# Altium project EmbeddedControlSystem_Hengeveld4331.PrjPcb (part 1 of 2)
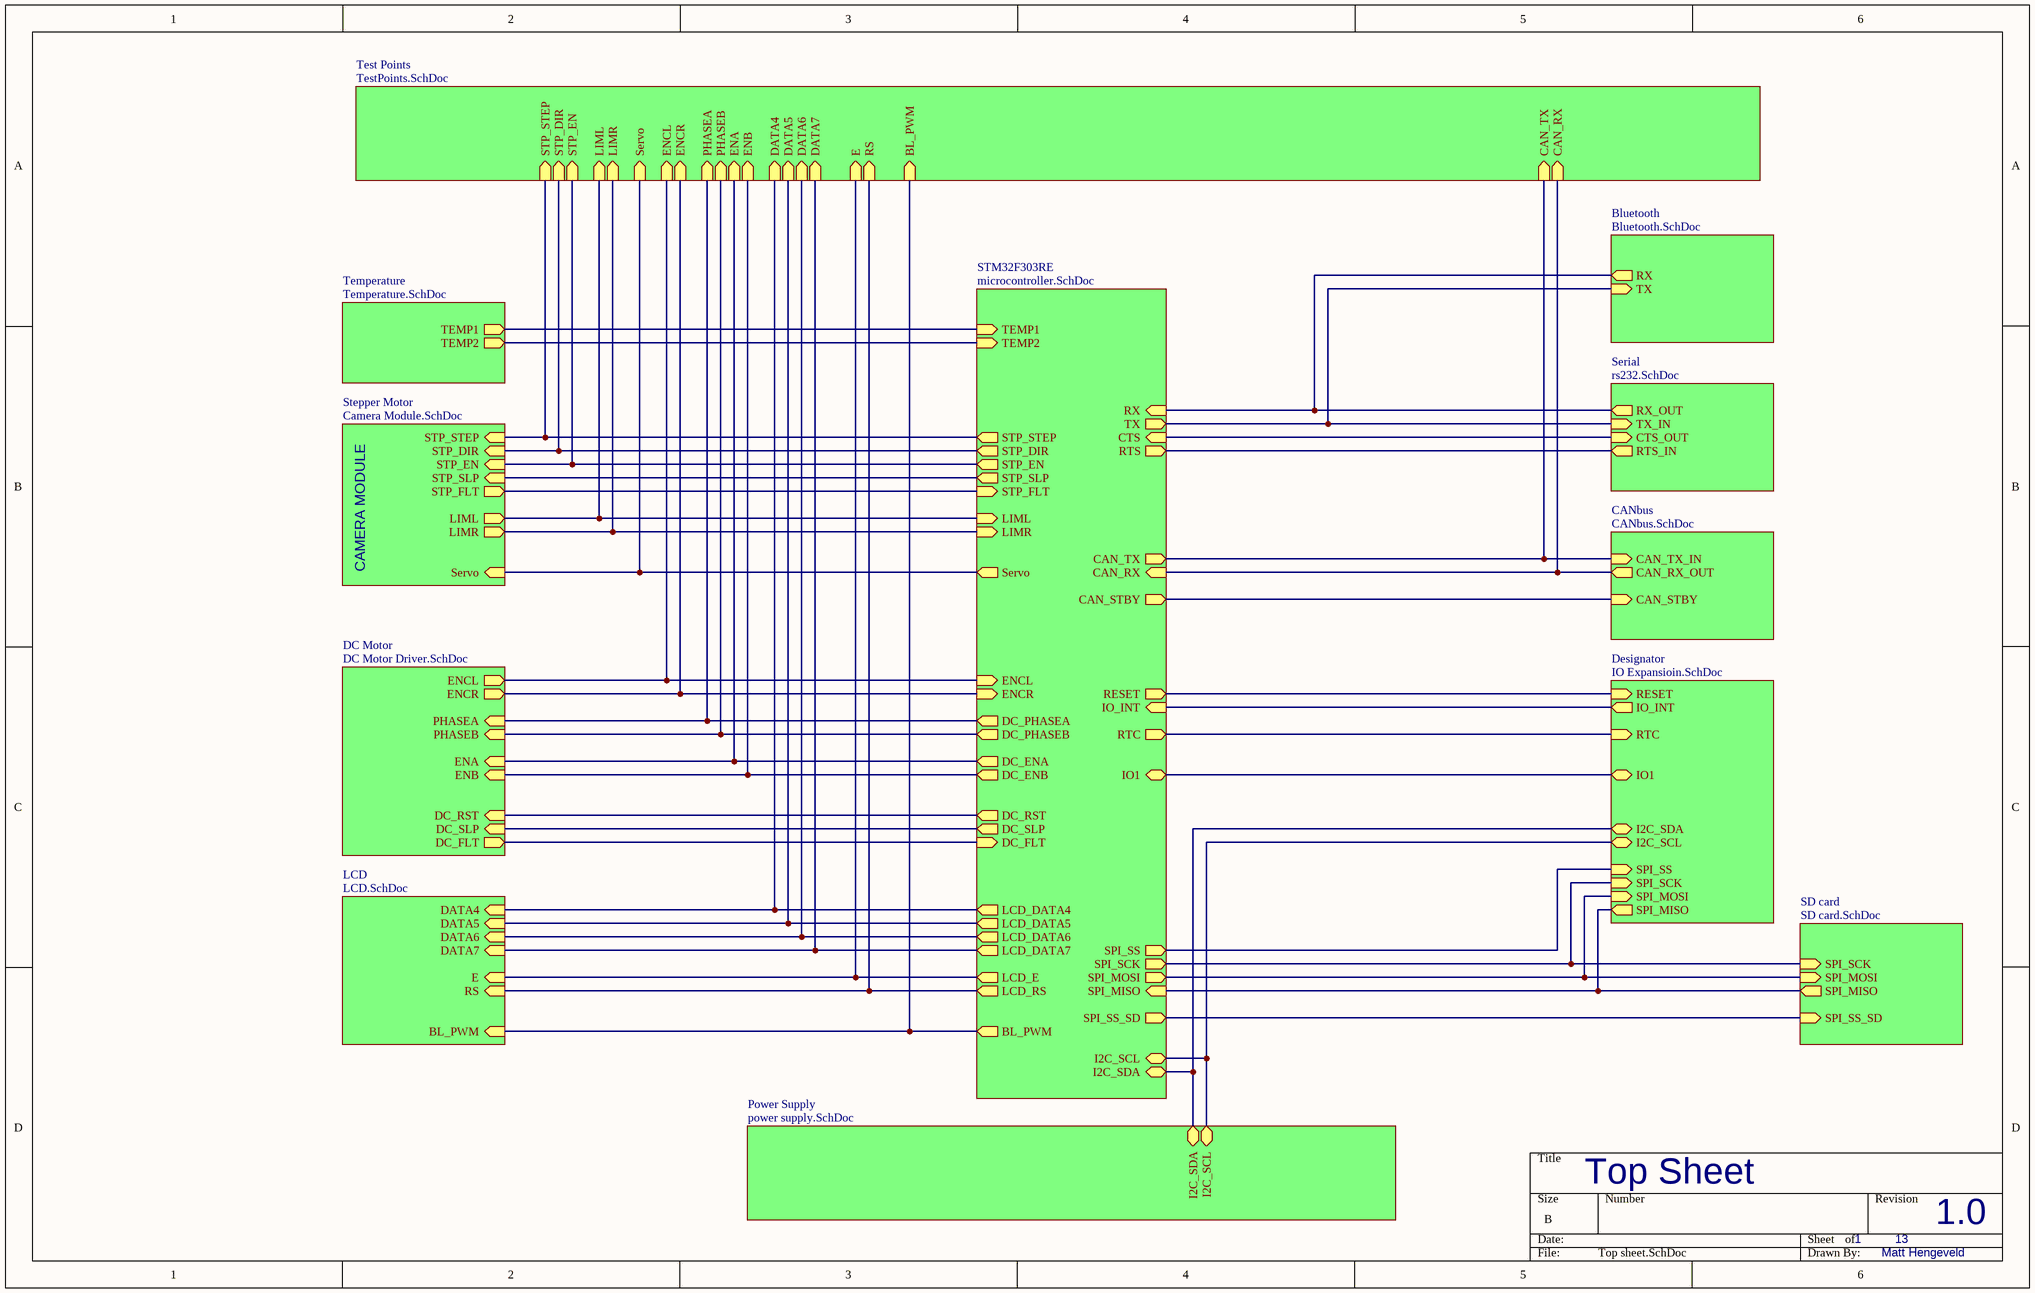
[diagram p0: Top sheet.SchDoc]
13 sheets, 193 parts. Net scope: hierarchical (ports join the sheet entries above them; power ports are global).
Board file: controller.PcbDoc
Sheets:
  Top sheet.SchDoc
    Power Supply = power supply.SchDoc
    STM32F303RE = microcontroller.SchDoc
    Stepper Motor = Camera Module.SchDoc
    DC Motor = DC Motor Driver.SchDoc
    LCD = LCD.SchDoc
    Serial = rs232.SchDoc
    CANbus = CANbus.SchDoc
    Designator = IO Expansioin.SchDoc
    Temperature = Temperature.SchDoc
    SD card = SD card.SchDoc
    Test Points = TestPoints.SchDoc
    Bluetooth = Bluetooth.SchDoc

## Sheet Top sheet.SchDoc
size B

### Sub-sheets
Bluetooth = Bluetooth.SchDoc: RX (out), TX (in)
CANbus = CANbus.SchDoc: CAN_TX_IN (in), CAN_RX_OUT (out), CAN_STBY (in)
DC Motor = DC Motor Driver.SchDoc: PHASEA (in), ENCL (out), ENA (in), DC_FLT (out), DC_SLP (in), DC_RST (in), ENCR (out), PHASEB (in), ENB (in)
Designator = IO Expansioin.SchDoc: SPI_MISO (out), SPI_MOSI (in), SPI_SCK (in), SPI_SS (in), IO_INT (out), RESET (in), I2C_SDA (bidir), I2C_SCL (bidir), RTC (in), IO1 (bidir)
LCD = LCD.SchDoc: DATA4 (in), E (in), RS (in), BL_PWM (in), DATA5 (in), DATA6 (in), DATA7 (in)
Power Supply = power supply.SchDoc: I2C_SDA (bidir), I2C_SCL (bidir)
SD card = SD card.SchDoc: SPI_SCK (in), SPI_MOSI (in), SPI_MISO (out), SPI_SS_SD (in)
Serial = rs232.SchDoc: TX_IN (in), RTS_IN (out), RX_OUT (out), CTS_OUT (in)
Stepper Motor = Camera Module.SchDoc: STP_STEP (in), LIML (out), STP_EN (in), STP_SLP (in), STP_FLT (out), Servo (in), STP_DIR (in), LIMR (out)
STM32F303RE = microcontroller.SchDoc: Servo (out), STP_STEP (out), DC_PHASEA (out), DC_ENA (out), LCD_RS (out), LCD_E (out), LCD_DATA4 (out), RX (in), CAN_TX (out), TX (out), CTS (in), RTS (out), CAN_RX (in), CAN_STBY (out), DC_FLT (in), DC_SLP (out), DC_RST (out), STP_FLT (in), STP_SLP (out), STP_EN (out), BL_PWM (out), ENCL (in), LIML (in), STP_DIR (out), SPI_SS (out), SPI_SCK (out), SPI_MOSI (out), I2C_SCL (bidir), I2C_SDA (bidir), SPI_MISO (in), IO_INT (in), RESET (out), LCD_DATA5 (out), LCD_DATA6 (out), LCD_DATA7 (out), ENCR (in), DC_PHASEB (out), DC_ENB (out), LIMR (in), RTC (out), IO1 (bidir), TEMP1 (in), TEMP2 (in), SPI_SS_SD (out)
Temperature = Temperature.SchDoc: TEMP1 (out), TEMP2 (out)
Test Points = TestPoints.SchDoc: STP_STEP (in), STP_DIR (in), STP_EN (in), LIML (in), LIMR (in), Servo (in), ENCL (in), ENCR (in), PHASEA (in), PHASEB (in), ENA (in), ENB (in), DATA4 (in), DATA5 (in), DATA6 (in), DATA7 (in), CAN_RX (in), CAN_TX (in), E (in), RS (in), BL_PWM (in)

### Nets
BL: sheet STM32F303RE/BL_PWM, sheet LCD/BL_PWM, sheet Test Points/BL_PWM
DB4: sheet STM32F303RE/LCD_DATA4, sheet LCD/DATA4, sheet Test Points/DATA4
DB5: sheet STM32F303RE/LCD_DATA5, sheet LCD/DATA5, sheet Test Points/DATA5
DB6: sheet STM32F303RE/LCD_DATA6, sheet LCD/DATA6, sheet Test Points/DATA6
DB7: sheet STM32F303RE/LCD_DATA7, sheet LCD/DATA7, sheet Test Points/DATA7
DC_FLT: sheet STM32F303RE/DC_FLT, sheet DC Motor/DC_FLT
DC_RST: sheet STM32F303RE/DC_RST, sheet DC Motor/DC_RST
DC_SLP: sheet STM32F303RE/DC_SLP, sheet DC Motor/DC_SLP
E: sheet STM32F303RE/LCD_E, sheet LCD/E, sheet Test Points/E
I2C_SCL: sheet Power Supply/I2C_SCL, sheet STM32F303RE/I2C_SCL, sheet Designator/I2C_SCL
I2C_SDA: sheet Power Supply/I2C_SDA, sheet STM32F303RE/I2C_SDA, sheet Designator/I2C_SDA
MISO: sheet STM32F303RE/SPI_MISO, sheet Designator/SPI_MISO, sheet SD card/SPI_MISO
MOSI: sheet STM32F303RE/SPI_MOSI, sheet Designator/SPI_MOSI, sheet SD card/SPI_MOSI
PA0: sheet STM32F303RE/CTS, sheet Serial/CTS_OUT
PA1: sheet STM32F303RE/RTS, sheet Serial/RTS_IN
PA2: sheet STM32F303RE/TX, sheet Serial/TX_IN, sheet Bluetooth/TX
PA3: sheet STM32F303RE/RX, sheet Serial/RX_OUT, sheet Bluetooth/RX
PA4: sheet STM32F303RE/LCD_RS, sheet LCD/RS, sheet Test Points/RS
PA5: sheet STM32F303RE/IO1, sheet Designator/IO1
PA6: sheet STM32F303RE/TEMP1, sheet Temperature/TEMP1
PA7: sheet STM32F303RE/TEMP2, sheet Temperature/TEMP2
PA8: sheet STM32F303RE/ENCL, sheet DC Motor/ENCL, sheet Test Points/ENCL
PA9: sheet STM32F303RE/ENCR, sheet DC Motor/ENCR, sheet Test Points/ENCR
PA10: sheet STM32F303RE/STP_FLT, sheet Stepper Motor/STP_FLT
PA11: sheet STM32F303RE/CAN_RX, sheet CANbus/CAN_RX_OUT, sheet Test Points/CAN_RX
PA12: sheet STM32F303RE/CAN_TX, sheet CANbus/CAN_TX_IN, sheet Test Points/CAN_TX
PA15: sheet STM32F303RE/Servo, sheet Stepper Motor/Servo, sheet Test Points/Servo
PB1: sheet STM32F303RE/LIML, sheet Stepper Motor/LIML, sheet Test Points/LIML
PB2: sheet STM32F303RE/LIMR, sheet Stepper Motor/LIMR, sheet Test Points/LIMR
PB3: sheet STM32F303RE/STP_EN, sheet Stepper Motor/STP_EN, sheet Test Points/STP_EN
PB4: sheet STM32F303RE/STP_DIR, sheet Stepper Motor/STP_DIR, sheet Test Points/STP_DIR
PB5: sheet STM32F303RE/STP_STEP, sheet Stepper Motor/STP_STEP, sheet Test Points/STP_STEP
PB6: sheet STM32F303RE/SPI_SS_SD, sheet SD card/SPI_SS_SD
PB10: sheet STM32F303RE/IO_INT, sheet Designator/IO_INT
PB11: sheet STM32F303RE/CAN_STBY, sheet CANbus/CAN_STBY
PB12: sheet STM32F303RE/SPI_SS, sheet Designator/SPI_SS
PB13: sheet STM32F303RE/SPI_SCK, sheet Designator/SPI_SCK, sheet SD card/SPI_SCK
PC4: sheet STM32F303RE/STP_SLP, sheet Stepper Motor/STP_SLP
PC5: sheet STM32F303RE/DC_PHASEA, sheet DC Motor/PHASEA, sheet Test Points/PHASEA
PC6: sheet STM32F303RE/DC_PHASEB, sheet DC Motor/PHASEB, sheet Test Points/PHASEB
PC8: sheet STM32F303RE/DC_ENA, sheet DC Motor/ENA, sheet Test Points/ENA
PC9: sheet STM32F303RE/DC_ENB, sheet DC Motor/ENB, sheet Test Points/ENB
PC13: sheet STM32F303RE/RTC, sheet Designator/RTC
RESET: sheet STM32F303RE/RESET, sheet Designator/RESET

### Notes on the sheet
- CAMERA MODULE
- Top Sheet
- 1
- 13
- 1.0
- Matt Hengeveld

## Sheet power supply.SchDoc
size A
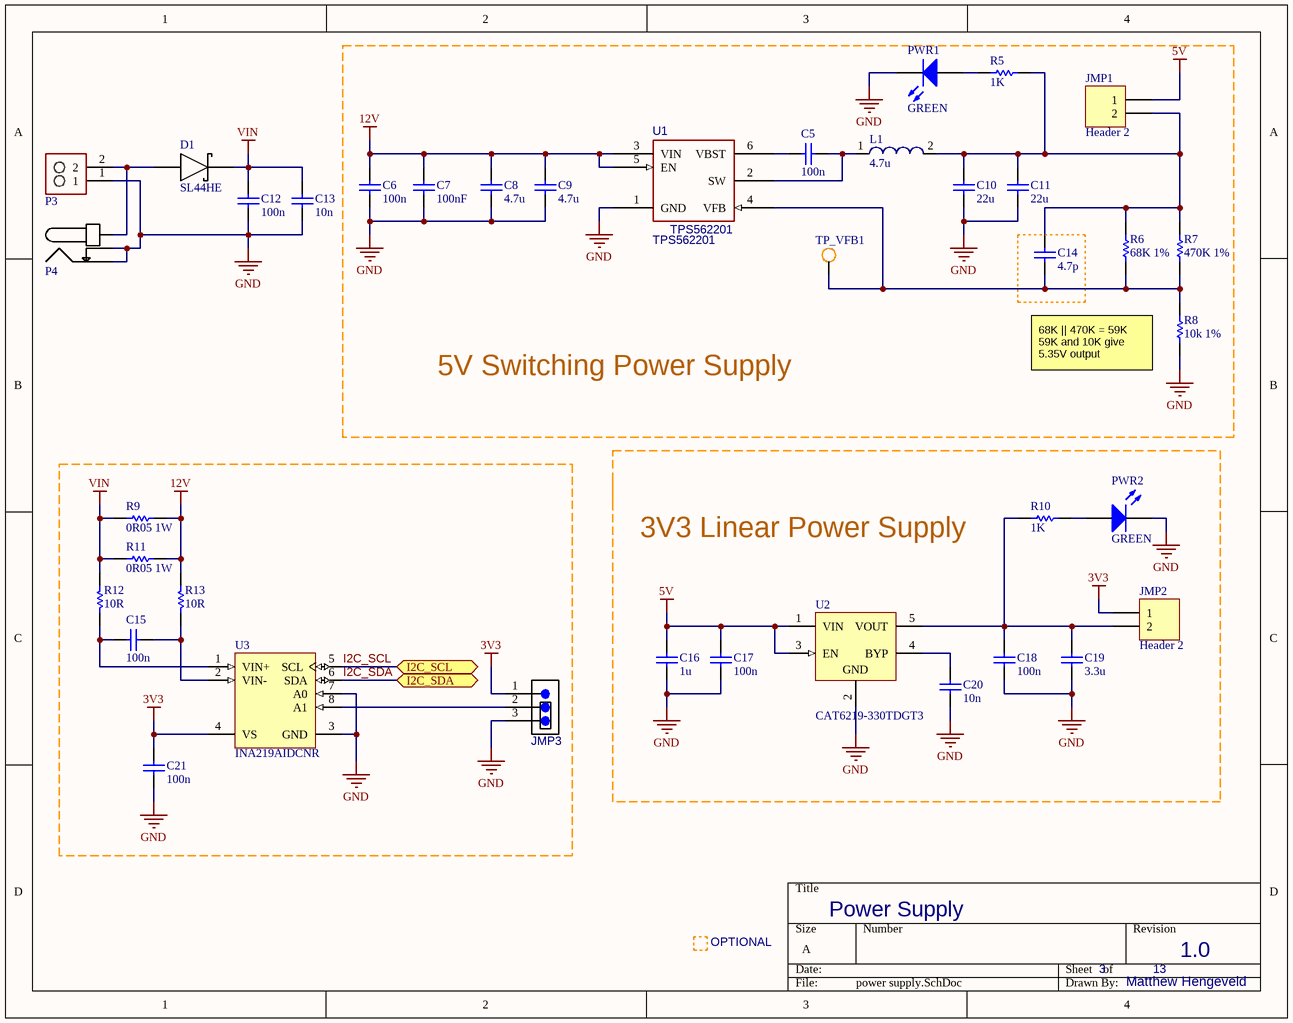
[diagram p1: power supply.SchDoc]

### Parts
C5  100n  [CAPC2113X100X50LL30T25]
C6  100n  [CAPC1608X90X35LL15T15]
C7  100nF  [CAPC2013X94X50LL20T25]
C8  4.7u  [CAPC3225X220X20ML40]
C9  4.7u  [CAPC3225X220X20ML40]
C10  22u  [CAPC3225X220X20ML40]
C11  22u  [CAPC3225X220X20ML40]
C12  100n  [CAPC2013X95X45LL15T25]
C13  10n  [CAPC2013X95X45LL15T25]
C14  4.7p  [CAPC1608X87X35LL15T15]
C15  100n  [CAPC1608X87X35LL15T15]
C16  1u  [CAPC2013X140X50LL20T25]
C17  100n  [CAPC1608X87X35LL15T15]
C18  100n  [CAPC1608X87X35LL15T15]
C19  3.3u  [CAPC3225X220X20ML40]
C20  10n  [CAPC1608X87X35LL15T15]
C21  100n  [CAPC1608X87X35LL15T15]
D1  SL44HE  [SMC Diode]
JMP1  Header 2  [HDR1X2]
JMP2  Header 2  [HDR1X2]
JMP3  SMD_JMP  [0603_JUMPER]  (value not drawn)
L1  4.7u  [WE-LQS 6045]
P3  2PIN_SCREW_TERM_3_5MM  [2PIN_SCREWW_TERM_3_5MM]  (value not drawn)
P4  Barrel Jack  [2.1x5.5mm Barrel Jack - Holes]  (value not drawn)
PWR1  GREEN  [0805_A]
PWR2  GREEN  [0805_A]
R5  1K  [RESC1608X55X30LL15T15]
R6  68K 1%  [RESC1608X55X30LL15T15]
R7  470K 1%  [RESC1608X55X30LL15T15]
R8  10k 1%  [RESC1608X55X30LL15T15]
R9  0R05 1W  [ROHM-MCR100-2_V]
R10  1K  [RESC1608X55X30LL15T15]
R11  0R05 1W  [ROHM-MCR100-2_V]
R12  10R  [RESC1608X55X30LL15T15]
R13  10R  [RESC1608X55X30LL15T15]
TP_VFB1  Test point  [SMD Test Hook]  (value not drawn)
U1  TPS562201  [MCHP-SOT-23-OT6_N]
U2  CAT6219-330TDGT3  [SOT-23-5]
U3  INA219AIDCNR  [SOT-23-8]

### Blocks framed on the sheet
5V Switching Power Supply: C5-C11 C14 JMP1 L1 PWR1 R5-R8 TP_VFB1 U1

### Ports
I2C_SCL (bidir), I2C_SDA (bidir)

### Nets
3V3: C21.2 JMP2.1 JMP3.1 U3.4(VS)
5V: C16.2 C17.2 JMP1.1 U2.1(VIN) U2.3(EN)
12V: C6.2 C7.1 C8.2 C9.2 R9.2 R11.2 R13.1 U1.3(VIN) U1.5(EN)
GND: C6.1 C7.2 C8.1 C9.1 C10.1 C11.1 C12.1 C13.1 C16.1 C17.1 C18.1 C19.1 C20.1 C21.1 JMP3.3 P3.1 P4.2 P4.3 PWR1.1(K) PWR2.1(K) R8.1 U1.1(GND) U2.2(GND) U3.3(GND) U3.7(A0)  [project net AGND]
VIN: C12.2 C13.2 D1.1(K) R9.1 R11.1 R12.1
I2C_SCL: U3.5(SCL) ; port I2C_SCL
I2C_SDA: U3.6(SDA) ; port I2C_SDA
NetC5_1: C5.1 U1.6(VBST)
NetC5_2: C5.2 L1.1 U1.2(SW)
NetC10_2: C10.2 C11.2 C14.2 JMP1.2 L1.2 R5.1 R6.2 R7.2
NetC14_1: C14.1 R6.1 R7.1 R8.2 TP_VFB1.1(point) U1.4(VFB)
NetC15_1: C15.1 R12.2 U3.1(VIN+)
NetC15_2: C15.2 R13.2 U3.2(VIN-)
NetC18_2: C18.2 C19.2 JMP2.2 R10.2 U2.5(VOUT)
NetC20_2: C20.2 U2.4(BYP)
NetD1_2: D1.2(A) P3.2 P4.1
NetJMP3_2: JMP3.2 U3.8(A1)
NetPWR1_2: PWR1.2(A) R5.2
NetPWR2_2: PWR2.2(A) R10.1

### Notes on the sheet
- (near R8) 68K || 470K = 59K
  59K and 10K give 5.35V output
- 3V3 Linear Power Supply
- OPTIONAL
- Power Supply
- 3
- 13
- 1.0
- Matthew Hengeveld

### Library data of the parts
C5 = CMP-2007-00009-1: Manufacturer: Kemet; Part Number: C0805X104K5RACTU
C6 = CMP-2006-04389-2: Chip Capacitor, 100 nF, +/- 10%, 50 V, -55 to 125 degC, 0603 (1608 Metric), RoHS, Tape and Reel; Case\Package: 0603; Type (Capacitors): X7R; Capacitance: 100 nF; Voltage Rating: 50 V; Pins: 2; Max Operating Temperature: 125 degC; Min Operating Temperature: -55 degC; Case Code (Imperial): 0603; DatasheetVersion: 07/2016; Package Quantity: 4000; Length: 1.6 mm; REACH SVHC: No SVHC; Packaging: Tape and Reel; Case Code (Metric): 1608; Mounting Technology: Surface Mount; RoHSCompliant: true; Height: 0.9 mm; ComponentLink1URL: http://www.avx.com/; ComponentLink2URL: http://datasheets.avx.com/X7RDielectric.pdf; Mount: Surface Mount; ComponentLink2Description: Datasheet; Width: 0.81 mm; PackageReference: 0603; PackageDescription: 2-Pin Surface Mount Device, Body 1.6 x 0.81 mm; Radiation Hardening: No; ComponentLink1Description: Manufacturer URL; Voltage Rating (DC): 50 V; Tolerance: 10%
C7 = CMP-2007-04370-1: Part Number: 08055C104K4T2A; Manufacturer: AVX Interconnect / Elco
C8-C11 C19 = CMP-2000-06054-1: Chip Capacitor, 4.7 uF, +/- 20%, 100 V, -55 to 125 degC, 1210 (3225 Metric), RoHS, Tape and Reel; PCN Part Number: MLCCPartNumberChange30/Nov/2012; Manufacturer: TDK; Online Catalog: CSeries,MidVoltage; Featured Product: MidVoltageX7S-100VMLCCsC-SeriesMidVoltageMLCCs; Capacitance: 4.7µF; Temperature Coefficient: X7S; Voltage - Rated: 100V; Product Training Modules: SEAT,CCV,andTVCLDesignToolsCSeriesMidVoltageCapacitorsFamilyGuidetoReplacinganElectrolyticCapacitorwithanMLCC; Other Names: 445-6043-6; Catalog Drawings: CSERIES_1210_2.2; Datasheet Version: 03/2015; Package Reference: 3225; Category: Capacitors; RoHS Information: RoHSCertificate-MLCC; Packaging: Digi-Reel®; Lead Spacing: -; Mounting Type: SurfaceMount,MLCC; Family: CeramicCapacitors; Applications: GeneralPurpose; Thickness (Max): 0.087"(2.20mm); Series: C; Height - Seated (Max): -; Datasheet URL: https://product.tdk.com/info/en/catalog/datasheets/mlcc_commercial_midvoltage_en.pdf; Lead Style: -; Features: -; Mounting Technology: SurfaceMount; Package / Case: 1210(3225Metric); Operating Temperature: -55°C~125°C; Manufacturer URL: http://www.tdk.com/; Standard Package: 1; Package Description: 2-Pin Surface Mount Device, Body 3.2 x 2.5 mm; Tolerance: ±20%; Ratings: -; Size / Dimension: 0.126"Lx0.098"W(3.20mmx2.50mm)
C12 C13 = CMP-2007-00072-1: Part Number: GCM2195C1H103JA16D; Manufacturer: Murata
C14 C17 C18 C20 = CMP-2006-03057-1: Manufacturer: Kemet; Part Number: C0603C104K3RACTU
C15 C21 = CMP-2006-03300-1: Part Number: C0603X104K5RACTU; Manufacturer: Kemet
C16 = CMP-2007-04672-1: Part Number: 0805ZC105KAT2A; Manufacturer: AVX Interconnect / Elco
D1 = SL44HE: Schottky Power Rectifier, 2-Pin SMC, 40V, 8A; PartNumber: MBRS540T3; Manufacturer: On Semiconductor; IFSM Max (A): 190; Configuration: Single; Packing: Tape and Reel; ComponentLink1Description: Manufacturer URL; ComponentLink3URL: http://www.onsemi.com/pub_link/Collateral/403-03.PDF; DatasheetVersion: Rev. 8; ComponentLink2Description: Datasheet; PackageReference: SMC-2-403-03; PackageDescription: 2-Pin Small Molded Package, J-Bend Lead, Body 5.845 x 6.855 mm; PackageVersion: Rev. E, 08/2005; ComponentLink1URL: http://www.onsemi.com/; ComponentLink2URL: http://www.onsemi.cn/pub_link/Collateral/MBRS540T3-D.PDF; RoHS: FALSE; ComponentLink3Description: Package Specification; Mounting Technology: Surface Mount
JMP1 JMP2 = Header 2: Header, 2-Pin; LatestRevisionDate: 17-Jul-2002; LatestRevisionNote: Re-released for DXP Platform.; Publisher: Altium Limited
L1 = CMP-1354-00077-1: WE-LQS SMD Power Inductor, L=4.7 µH; Manufacturer: Wuerth Elektronik; PartNumber: 74404064047; Inductance: 4.7 ÂµH; PackageReference: WE-LQS 6045; ComponentLink2URL: http://katalog.we-online.de/pbs/datasheet/74404064047.pdf; ComponentLink1Description: Manufacturer URL; ComponentLink1URL: http://www.we-online.com; ComponentLink2Description: Datasheet
PWR1 PWR2 = CMP-1426-00011-1: SMD mono-color Chip LED, WL-SMCW, Red; PartNumber: 150080RS75000; Manufacturer: Wuerth Elektronik; Color: Red; PackageReference: 0805_A; ComponentLink2Description: Datasheet; ComponentLink1URL: http://www.we-online.com; ComponentLink1Description: Manufacturer URL; ComponentLink2URL: http://katalog.we-online.com/led/datasheet/150080RS75000.pdf
R5-R8 R10 = CMP-2000-00181-1: Part Number: ERJ-3EKF1002V; Manufacturer: Panasonic
R9 R11 = CMP-1238-00003-1: PartNumber: MCR100JZHFLR470; Manufacturer: ROHM Semiconductor; Resistance: 0.47 Ohm; Packing: Tape; Overload Voltage: 6.02 V Max.; Limiting Element Voltage: 3.01 V; Resistance Tolerance: +/-1%; PackageDescription: 2-Pin Chip Resistor, Body 6.3 x 3.2 mm, Height 0.7 mm; Rated Power@70 degC: 1 W; ComponentLink3Description: Package Specification; ComponentLink2Description: Datasheet; DatasheetVersion: Rev. C; ComponentLink2URL: http://rohmfs.rohm.com/en/products/databook/datasheet/passive/resistor/chip_resistor/mcr_low.pdf; Operating Temperature: -55 to 125 degC; ComponentLink3URL: http://rohmfs.rohm.com/en/products/databook/datasheet/passive/resistor/chip_resistor/mcr_low.pdf; ComponentLink1URL: http://www.rohm.com/web/global/; Mounting Technology: Surface Mount; RoHS: TRUE; ComponentLink1Description: Manufacturer URL
R12 R13 = CMP-2000-00704-1: Manufacturer: Panasonic; Part Number: ERJ-3GEYJ103V
U2 = CAT6219: Fixed Low Drop Positive Voltage Regulator, 3.3V, 5-Pin TSOT-23, Tape and Reel; Manufacturer: ON Semiconductor; PSRR (dB): 64; VI Max (V): 5.5; Output: Single; Iq Typ (mA): 0.085; Noise (uVrms): 45; VDO Typ (V): 0.3; Io Typ(A): 0.5; Vo(V): 3.3; Polarity: Positive; DatasheetVersion: Rev. 14; Package Type: TSOT-23-5; RoHS: Pb-free; Mounting Technology: Surface Mount; ComponentLink1URL: http://www.onsemi.com/; PartNumber: CAT6219-330TDGT3; ComponentLink3Description: Package Specification; ComponentLink2URL: http://www.onsemi.com/pub_link/Collateral/CAT6219-D.PDF; ComponentLink3URL: http://www.onsemi.com/pub_link/Collateral/419AE.PDF; PackageVersion: Rev. O; ComponentLink1Description: Manufacturer URL; PackageReference: TSOT-23; ComponentLink2Description: Datasheet; PackageDescription: 5-Pin Plastic Small Outline Package, Body 2.9 x 1.6mm, Pitch 0.95mm
U3 = INA219: Zero-Drift, Bi-directional Current / Power Monitor, 3 to 5.5 V, -40 to 125 degC, 8-pin SOP (DCN8), Green (RoHS & no Sb/Br); Manufacturer: Texas Instruments; Input Offset (+/-)(Max)(uV): 100; Small-Signal Bandwidth(Typ)(MHz): 0.011; SubFamily: Current Shunt Monitor; Rating: Catalog; Quiescent Current (+/-)(Typ)(mA): 0.7; Vs(Max)(V): 5.5; Common Mode Range(Min)(V): 0; Vs(Min)(V): 3; Common Mode Range(Max)(V): 26; Gain(V/V): 1, 0.5, 0.25, 0.125; ComponentLink3URL: http://www.ti.com/lit/ml/mpds099c/mpds099c.pdf; ComponentLink2URL: http://www.ti.com/general/docs/lit/getliterature.tsp?genericPartNumber=INA219&fileType=pdf; PackageReference: DCN0008A; ComponentLink1URL: http://www.ti.com/; ComponentLink1Description: Manufacturer URL; Code_JEDEC: MO-178; CMRR(Min)(dB): 100; DatasheetVersion: SBOS448F; Mounting Technology: Surface Mount; ComponentLink3Description: Package Specification; PartNumber: INA219AIDCNR; PackageVersion: 4202106/D, 11/2009; Eco-Plan: Green (RoHS & no Sb/Br); ComponentLink2Description: Datasheet; PackageDescription: 8-Pin Plastic Small Outline, Body 1.6 x 2.9 mm, Pitch 0.65 mm

## Sheet microcontroller.SchDoc
size A4
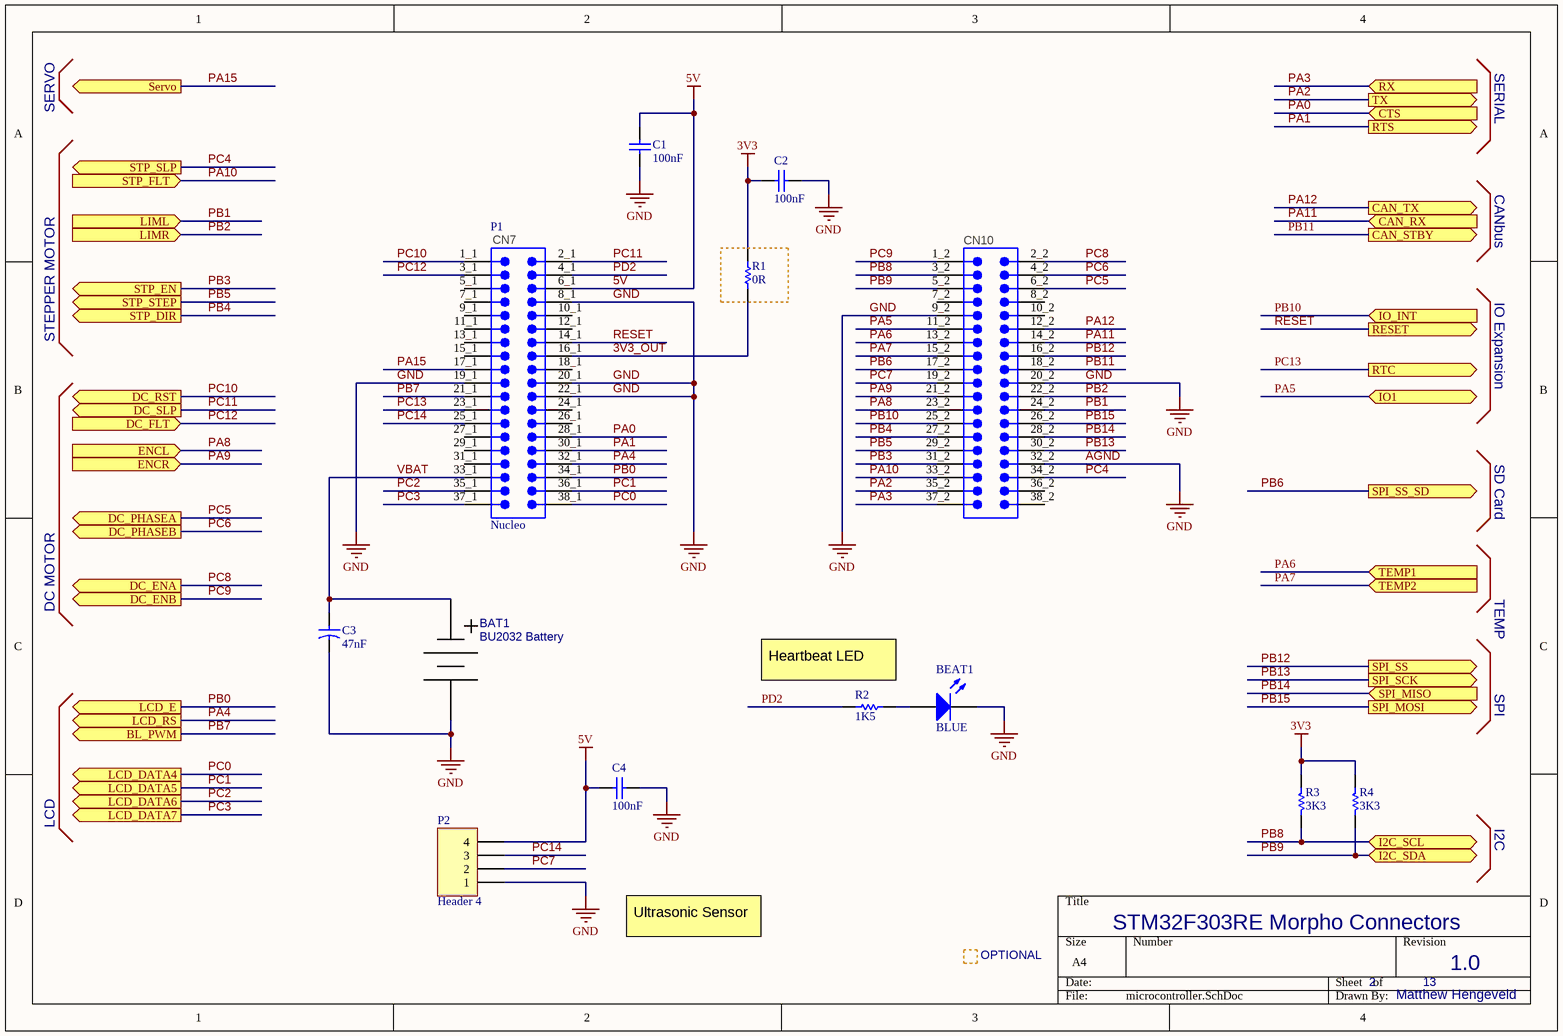
[diagram p2: microcontroller.SchDoc]

### Parts
BAT1  BU2032 Battery  [BU2032]
BEAT1  BLUE  [0805_A]
C1  100nF  [CAPC1608X92X38LL15T08]
C2  100nF  [CAPC1608X92X38LL15T08]
C3  47nF  [FILM_CAp]
C4  100nF  [CAPC1608X92X38LL15T08]
P1  Nucleo  [NUCLEO]
P2  Header 4  [HDR1X4]
R1  0R  [RESC1608X55X30LL15T15]
R2  1K5  [RESC1608X55X30LL15T15]
R3  3K3  [RESC1608X55X30LL15T15]
R4  3K3  [RESC1608X55X30LL15T15]

### Ports
BL_PWM (out), CAN_RX (in), CAN_STBY (out), CAN_TX (out), CTS (in), DC_ENA (out), DC_ENB (out), DC_FLT (in), DC_PHASEA (out), DC_PHASEB (out), DC_RST (out), DC_SLP (out), ENCL (in), ENCR (in), I2C_SCL (bidir), I2C_SDA (bidir), IO1 (bidir), IO_INT (in), LCD_DATA4 (out), LCD_DATA5 (out), LCD_DATA6 (out), LCD_DATA7 (out), LCD_E (out), LCD_RS (out), LIML (in), LIMR (in), RESET (out), RTC (out), RTS (out), RX (in), Servo (out), SPI_MISO (in), SPI_MOSI (out), SPI_SCK (out), SPI_SS (out), SPI_SS_SD (out), STP_DIR (out), STP_EN (out), STP_FLT (in), STP_SLP (out), STP_STEP (out), TEMP1 (in), TEMP2 (in), TX (out)

### Nets
3V3: C2.2 R1.2 R3.1 R4.1
5V: C1.2 C4.2 P1.6_1 P2.4
AGND: BAT1.- BEAT1.1(K) C1.1 C2.1 C3.2 C4.1 P1.8_1 P1.9_2 P1.19_1 P1.20_1 P1.20_2 P1.22_1 P1.32_2 P2.1  [also labelled GND]
3V3_OUT: P1.16_1 R1.1
PA0: P1.28_1 ; port CTS
PA1: P1.30_1 ; port RTS
PA2: P1.35_2 ; port TX
PA3: P1.37_2 ; port RX
PA4: P1.32_1 ; port LCD_RS
PA5: P1.11_2 ; port IO1
PA6: P1.13_2 ; port TEMP1
PA7: P1.15_2 ; port TEMP2
PA8: P1.23_2 ; port ENCL
PA9: P1.21_2 ; port ENCR
PA10: P1.33_2 ; port STP_FLT
PA11: P1.14_2 ; port CAN_RX
PA12: P1.12_2 ; port CAN_TX
PA15: P1.17_1 ; port Servo
PB0: P1.34_1 ; port LCD_E  [project net E]
PB1: P1.24_2 ; port LIML
PB2: P1.22_2 ; port LIMR
PB3: P1.31_2 ; port STP_EN
PB4: P1.27_2 ; port STP_DIR
PB5: P1.29_2 ; port STP_STEP
PB6: P1.17_2 ; port SPI_SS_SD
PB7: P1.21_1 ; port BL_PWM  [project net BL]
PB8: P1.3_2 R3.2 ; port I2C_SCL  [project net I2C_SCL]
PB9: P1.5_2 R4.2 ; port I2C_SDA  [project net I2C_SDA]
PB10: P1.25_2 ; port IO_INT
PB11: P1.18_2 ; port CAN_STBY
PB12: P1.16_2 ; port SPI_SS
PB13: P1.30_2 ; port SPI_SCK
PB14: P1.28_2 ; port SPI_MISO  [project net MISO]
PB15: P1.26_2 ; port SPI_MOSI  [project net MOSI]
PC0: P1.38_1 ; port LCD_DATA4  [project net DB4]
PC1: P1.36_1 ; port LCD_DATA5  [project net DB5]
PC2: P1.35_1 ; port LCD_DATA6  [project net DB6]
PC3: P1.37_1 ; port LCD_DATA7  [project net DB7]
PC4: P1.34_2 ; port STP_SLP
PC5: P1.6_2 ; port DC_PHASEA
PC6: P1.4_2 ; port DC_PHASEB
PC7: P1.19_2 P2.2
PC8: P1.2_2 ; port DC_ENA
PC9: P1.1_2 ; port DC_ENB
PC10: P1.1_1 ; port DC_RST  [project net DC_RST]
PC11: P1.2_1 ; port DC_SLP  [project net DC_SLP]
PC12: P1.3_1 ; port DC_FLT  [project net DC_FLT]
PC13: P1.23_1 ; port RTC
PC14: P1.25_1 P2.3
PD2: P1.4_1 R2.1
RESET: P1.14_1 ; port RESET
VBAT: BAT1.+ C3.1 P1.33_1
NetBEAT1_2: BEAT1.2(A) R2.2

Not connected (* = marked no-connect by the designer): P1 5_1(5) 7_1(7) 7_2(7) 8_2(8) 9_1(9) 10_1(10) 10_2(10) 11_1(11) 12_1(12) 13_1(13) 15_1(15) 18_1(18) 24_1(24) 26_1(26) 27_1(27) 29_1(29) 31_1(31) 36_2(36) 38_2(38)

### Notes on the sheet
- SERVO
- SERIAL
- CANbus
- IO Expansion
- STEPPER MOTOR
- SD Card
- DC MOTOR
- TEMP
- (near R2) Heartbeat LED
- SPI
- LCD
- I2C
- Ultrasonic Sensor
- OPTIONAL
- STM32F303RE Morpho Connectors
- 2
- 13
- 1.0
- Matthew Hengeveld
- (in symbol Nucleo) CN7; CN10

### Library data of the parts
BEAT1 = CMP-1426-00011-1: as PWR1 on sheet power supply; Color: Red; PackageReference: 0805_A; ComponentLink2Description: Datasheet; ComponentLink1URL: http://www.we-online.com; ComponentLink1Description: Manufacturer URL; ComponentLink2URL: http://katalog.we-online.com/led/datasheet/150080RS75000.pdf
C1 C2 C4 = CMP-2006-01974-1: Part Number: VJ0603Y104KNXAO; Manufacturer: Vitramon
C3 = CAP-FILM: Aluminum Electrolytic Capacitor, UD Series, Low Impedance, 100 uF, 35 V, + / - 20%, -55 to 105 degC, Chip Type, 8 x 10 mm D x L, Pb-Free, Reel; PartNumber: UUD1V101MNL1GS; Manufacturer: Nichicon; Rated Ripple Current (at 100kHz): 450 mA; Packing: Dia382mm Reel; Endurance Time: 5000 h; Impedance: 0.17 Ohm; Rated Voltage: 35 V; Rated Capacitance: 100 uF; Tolerance Rated Capacitance: -20 to 20%; ComponentLink2URL: http://products.nichicon.co.jp/en/pdf/XJA043/e-ud.pdf; DatasheetVersion: 08/2012; ComponentLink1Description: Manufacturer URL; Diameter: 8 mm; RoHS: TRUE; ComponentLink3Description: Package Specification; Mounting Technology: Surface Mount; ComponentLink3URL: http://products.nichicon.co.jp/en/pdf/XJA043/e-ud.pdf; Length: 10 mm; PackageReference: CAPAE-D8H10; ComponentLink1URL: http://www.nichicon.co.jp/; ComponentLink2Description: Datasheet; PackageDescription: 2-Pin Surface Mount Device, Diameter 8 mm, Height 10 mm, Pitch 6.5 mm
P1 = Nucleo: STM32F303 Nucleo Development Board; Manufacturer: Samtec; PartNumber: HW-20-08-F-D-255-090; Pitch: 2.54 mm; DatasheetVersion: F-214; PackageVersion: Y, 8/1991; PackageReference: HW-20-08-X-D-255-090; PackageDescription: .100[2.54] High Temp Terminal Body (Board Stacking); Orientation: Vertical; RoHS: True; Temperature Range: -55 to 125 degC; Mounting Technology: Through-hole; ComponentLink1Description: Datasheet; ComponentLink1URL: http://www.samtec.com/documents/webfiles/pdf/HW_TH.PDF; ComponentLink2Description: Package Specification; ComponentLink2URL: http://www.samtec.com/documents/webfiles/cpdf/HW-XX-XX-XX-X-XXX-XXX-XX-XXX-MKT.pdf
P2 = Header 4: Header, 4-Pin; LatestRevisionDate: 17-Jul-2002; LatestRevisionNote: Re-released for DXP Platform.; Publisher: Altium Limited
R1-R4 = CMP-2000-00704-1: as R12 on sheet power supply

## Sheet Camera Module.SchDoc
size A
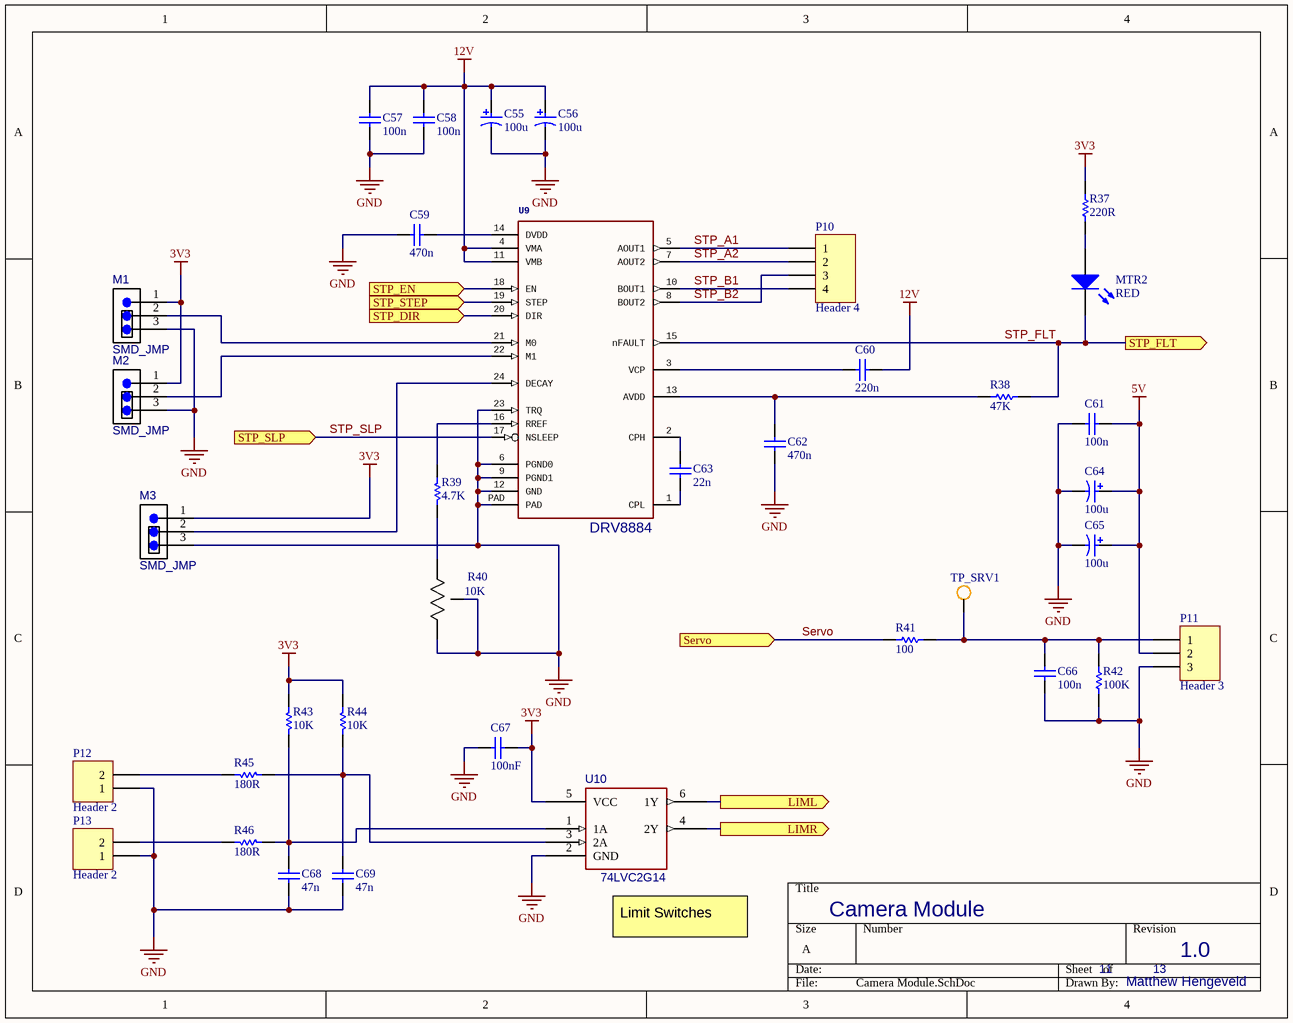
[diagram p3: Camera Module.SchDoc]

### Parts
C55  100u  [SMD-CAP-0606]
C56  100u  [SMD-CAP-0606]
C57  100n  [CAPC1608X87X35LL15T15]
C58  100n  [CAPC1608X87X35LL15T15]
C59  470n  [CAPC1608X87X35LL15T15]
C60  220n  [CAPC1608X87X35LL15T15]
C61  100n  [CAPC1608X87X35LL15T15]
C62  470n  [CAPC1608X90X35LL10T15]
C63  22n  [CAPC1608X87X35LL15T15]
C64  100u  [SMD-CAP-0606]
C65  100u  [SMD-CAP-0606]
C66  100n  [CAPC1608X90X35LL10T15]
C67  100nF  [CAPC1608X92X38LL15T08]
C68  47n  [CAPC1608X87X35LL15T15]
C69  47n  [CAPC1608X87X35LL15T15]
M1  SMD_JMP  [0603_JUMPER]
M2  SMD_JMP  [0603_JUMPER]
M3  SMD_JMP  [0603_JUMPER]
MTR2  RED  [0805_A]
P10  Header 4  [HDR1X4]
P11  Header 3  [HDR1X3]
P12  Header 2  [HDR1X2]
P13  Header 2  [HDR1X2]
R37  220R  [RESC1608X55X30LL15T15]
R38  47K  [RESC1608X55X30LL15T15]
R39  4.7K  [RESC1608X55X30LL15T15]
R40  10K  [TRIMMER-TC33]
R41  100  [RESC1608X55X30LL15T15]
R42  100K  [RESC1608X55X30LL15T15]
R43  10K  [RESC1608X55X30LL15T15]
R44  10K  [RESC1608X55X30LL15T15]
R45  180R  [RESC1608X55X30LL15T15]
R46  180R  [RESC1608X55X30LL15T15]
TP_SRV1  Test point  [SMD Test Hook]  (value not drawn)
U9  DRV8884  [TI-PWP24]  (value not drawn)
U10  74LVC2G14  [ONSC-SOT-363-6-419B-02_V]  (value not drawn)

### Ports
LIML (out), LIMR (out), Servo (in), STP_DIR (in), STP_EN (in), STP_FLT (out), STP_SLP (in), STP_STEP (in)

### Nets
3V3: C67.2 M1.1 M2.1 M3.1 R37.1 R43.1 R44.1 U10.5(VCC)
5V: C61.1 C64.1 C65.1 P11.2
12V: C55.1 C56.1 C57.2 C58.2 C60.1 U9.4(VMA) U9.11(VMB)
GND: C55.2 C56.2 C57.1 C58.1 C59.2 C61.2 C62.1 C64.2 C65.2 C66.1 C67.1 C68.2 C69.2 M1.3 M2.3 M3.3 P11.3 P12.1 P13.1 R40.2 R40.3 R42.2 U9.6(PGND0) U9.9(PGND1) U9.12(GND) U9.23(TRQ) U9.PAD U10.2(GND)  [project net AGND]
PB1: U10.6(1Y) ; port LIML
PB2: U10.4(2Y) ; port LIMR
PB3: U9.18(EN) ; port STP_EN
PB4: U9.20(DIR) ; port STP_DIR
PB5: U9.19(STEP) ; port STP_STEP
Servo: R41.2 ; port Servo  [project net PA15]
STP_A1: P10.1 U9.5(AOUT1)
STP_A2: P10.2 U9.7(AOUT2)
STP_B1: P10.4 U9.10(BOUT1)
STP_B2: P10.3 U9.8(BOUT2)
STP_FLT: MTR2.1(K) R38.2 U9.15(nFAULT) ; port STP_FLT  [project net PA10]
STP_SLP: U9.17(NSLEEP) ; port STP_SLP  [project net PC4]
NetC59_1: C59.1 U9.14(DVDD)
NetC60_2: C60.2 U9.3(VCP)
NetC62_2: C62.2 R38.1 U9.13(AVDD)
NetC63_1: C63.1 U9.1(CPL)
NetC63_2: C63.2 U9.2(CPH)
NetC66_2: C66.2 P11.1 R41.1 R42.1 TP_SRV1.1(point)
NetC68_1: C68.1 R43.2 R46.2 U10.1(1A)
NetC69_1: C69.1 R44.2 R45.2 U10.3(2A)
NetM1_2: M1.2 U9.21(M0)
NetM2_2: M2.2 U9.22(M1)
NetM3_2: M3.2 U9.24(DECAY)
NetMTR2_2: MTR2.2(A) R37.2
NetP12_2: P12.2 R45.1
NetP13_2: P13.2 R46.1
NetR39_1: R39.1 U9.16(RREF)
NetR39_2: R39.2 R40.1

### Notes on the sheet
- (near U9) DRV8884
- (near U10) Limit Switches
- Camera Module
- 11
- 13
- 1.0
- Matthew Hengeveld

### Library data of the parts
C55 C56 C64 C65 = CAP-EL-0606-SMD: Aluminum Electrolytic Capacitor, UD Series, Low Impedance, 100 uF, 35 V, + / - 20%, -55 to 105 degC, Chip Type, 8 x 10 mm D x L, Pb-Free, Reel; PartNumber: UUD1V101MNL1GS; Manufacturer: Nichicon; Rated Ripple Current (at 100kHz): 450 mA; Packing: Dia382mm Reel; Endurance Time: 5000 h; Impedance: 0.17 Ohm; Rated Voltage: 35 V; Rated Capacitance: 100 uF; Tolerance Rated Capacitance: -20 to 20%; ComponentLink2URL: http://products.nichicon.co.jp/en/pdf/XJA043/e-ud.pdf; DatasheetVersion: 08/2012; ComponentLink1Description: Manufacturer URL; Diameter: 8 mm; RoHS: TRUE; ComponentLink3Description: Package Specification; Mounting Technology: Surface Mount; ComponentLink3URL: http://products.nichicon.co.jp/en/pdf/XJA043/e-ud.pdf; Length: 10 mm; PackageReference: CAPAE-D8H10; ComponentLink1URL: http://www.nichicon.co.jp/; ComponentLink2Description: Datasheet; PackageDescription: 2-Pin Surface Mount Device, Diameter 8 mm, Height 10 mm, Pitch 6.5 mm
C57-C61 C68 C69 = CMP-2006-03300-1: as C15 on sheet power supply
C62 C66 = CMP-2006-02860-1: Manufacturer: Murata; Part Number: GRM188R71C474KA88D
C63 = CMP-2006-03036-1: Manufacturer: Kemet; Part Number: C0603C103K1RACTU
C67 = CMP-2006-01974-1: as C1 on sheet microcontroller
MTR2 = CMP-1426-00011-1: as PWR1 on sheet power supply; Color: Red; PackageReference: 0805_A; ComponentLink2Description: Datasheet; ComponentLink1URL: http://www.we-online.com; ComponentLink1Description: Manufacturer URL; ComponentLink2URL: http://katalog.we-online.com/led/datasheet/150080RS75000.pdf
P10 = Header 4: Header, 4-Pin; LatestRevisionDate: 17-Jul-2002; LatestRevisionNote: Re-released for DXP Platform.; Publisher: Altium Limited
P11 = Header 3: Header, 3-Pin; LatestRevisionDate: 17-Jul-2002; LatestRevisionNote: Re-released for DXP Platform.; Publisher: Altium Limited
P12 P13 = Header 2: Header, 2-Pin; LatestRevisionDate: 17-Jul-2002; LatestRevisionNote: Re-released for DXP Platform.; Publisher: Altium Limited
R37-R39 R41-R46 = CMP-2000-00704-1: as R12 on sheet power supply
R40 = Trimmer
U9 = DRV8884: GateName_1: G$1; SymbolName_1: DRV8843; LibraryName: DRV88xx; DeviceSetName: DRV8843; Package: HTSSOP28PWP

## Sheet DC Motor Driver.SchDoc
size A
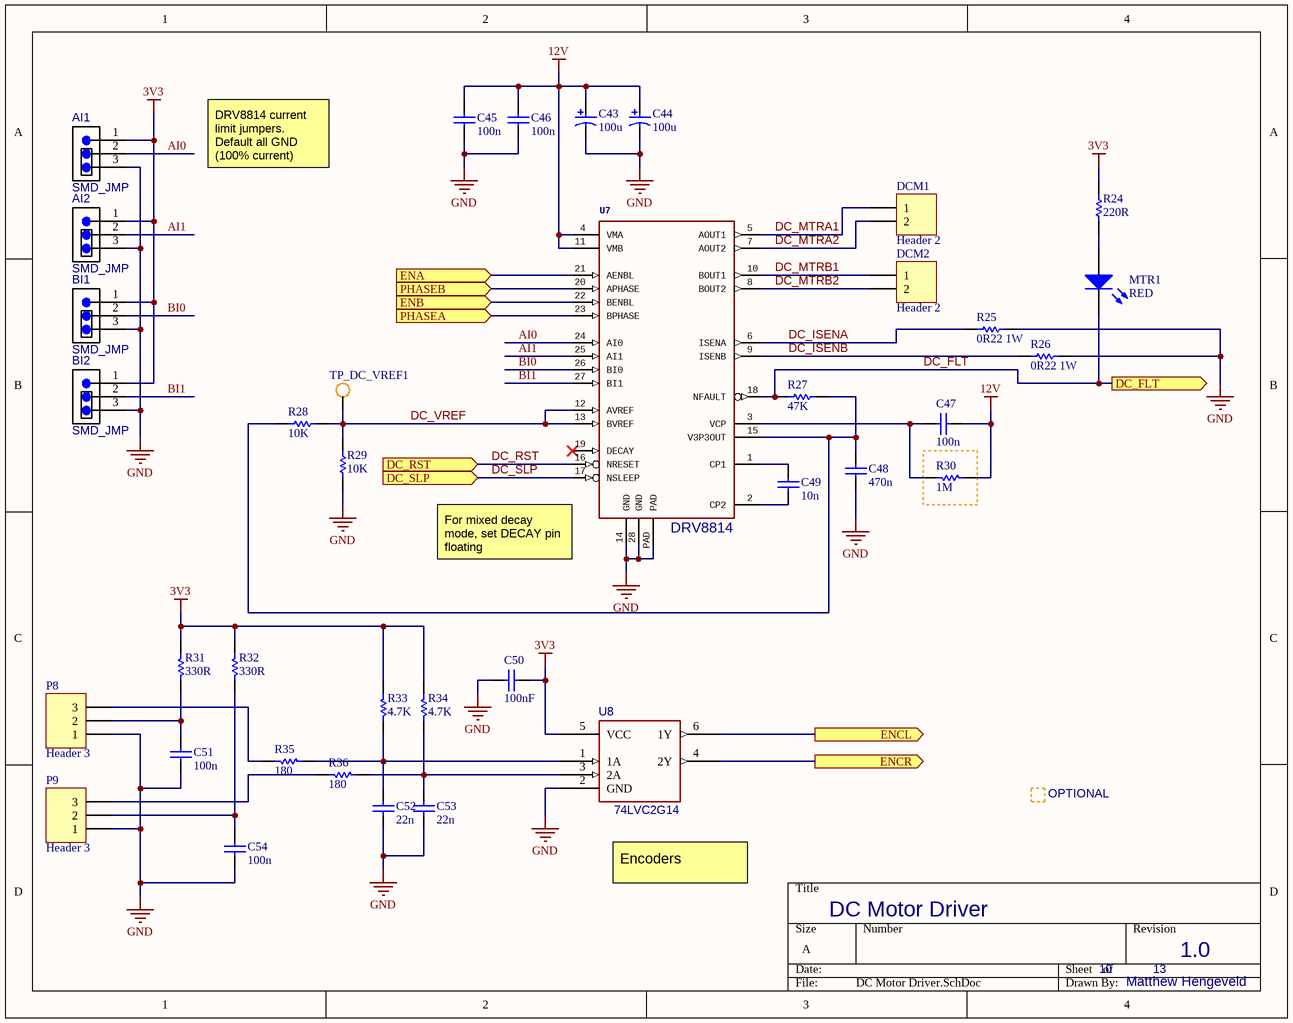
[diagram p4: DC Motor Driver.SchDoc]

### Parts
AI1  SMD_JMP  [0603_JUMPER]
AI2  SMD_JMP  [0603_JUMPER]
BI1  SMD_JMP  [0603_JUMPER]
BI2  SMD_JMP  [0603_JUMPER]
C43  100u  [SMD-CAP-0606]
C44  100u  [SMD-CAP-0606]
C45  100n  [CAPC1608X87X35LL15T15]
C46  100n  [CAPC1608X87X35LL15T15]
C47  100n  [CAPC1608X87X35LL15T15]
C48  470n  [CAPC1608X90X35LL10T15]
C49  10n  [CAPC1608X87X35LL15T15]
C50  100nF  [CAPC1608X92X38LL15T08]
C51  100n  [CAPC1608X87X35LL15T15]
C52  22n  [CAPC1608X87X35LL15T15]
C53  22n  [CAPC1608X87X35LL15T15]
C54  100n  [CAPC1608X87X35LL15T15]
DCM1  Header 2  [HDR1X2]
DCM2  Header 2  [HDR1X2]
MTR1  RED  [0805_A]
P8  Header 3  [HDR1X3]
P9  Header 3  [HDR1X3]
R24  220R  [RESC1608X55X30LL15T15]
R25  0R22 1W  [ROHM-MCR100-2_V]
R26  0R22 1W  [ROHM-MCR100-2_V]
R27  47K  [RESC1608X55X30LL15T15]
R28  10K  [RESC1608X55X30LL15T15]
R29  10K  [RESC1608X55X30LL15T15]
R30  1M  [RESC1608X55X30LL15T15]
R31  330R  [RESC1608X55X30LL15T15]
R32  330R  [RESC1608X55X30LL15T15]
R33  4.7K  [RESC1608X55X30LL15T15]
R34  4.7K  [RESC1608X55X30LL15T15]
R35  180  [RESC1608X55X30LL15T15]
R36  180  [RESC1608X55X30LL15T15]
TP_DC_VREF1  Test point  [SMD Test Hook]  (value not drawn)
U7  DRV8814  [TI-PWP28]  (value not drawn)
U8  74LVC2G14  [ONSC-SOT-363-6-419B-02_V]  (value not drawn)

### Ports
DC_FLT (out), DC_RST (in), DC_SLP (in), ENA (in), ENB (in), ENCL (out), ENCR (out), PHASEA (in), PHASEB (in)

### Nets
3V3: AI1.1 AI2.1 BI1.1 BI2.1 C50.2 R24.1 R31.2 R32.2 R33.1 R34.1 U8.5(VCC)
12V: C43.1 C44.1 C45.2 C46.2 C47.1 R30.1 U7.4(VMA) U7.11(VMB)
GND: AI1.3 AI2.3 BI1.3 BI2.3 C43.2 C44.2 C45.1 C46.1 C48.1 C50.1 C51.2 C52.2 C53.2 C54.2 P8.1 P9.1 R25.2 R26.2 R29.1 U7.14(GND) U7.28(GND) U7.PAD U8.2(GND)  [project net AGND]
AI0: AI1.2 U7.24(AI0)
AI1: AI2.2 U7.25(AI1)
BI0: BI1.2 U7.26(BI0)
BI1: BI2.2 U7.27(BI1)
DC_FLT: MTR1.1(K) R27.2 U7.18(NFAULT) ; port DC_FLT
DC_ISENA: R25.1 U7.6(ISENA)
DC_ISENB: R26.1 U7.9(ISENB)
DC_MTRA1: DCM1.1 U7.5(AOUT1)
DC_MTRA2: DCM1.2 U7.7(AOUT2)
DC_MTRB1: DCM2.1 U7.10(BOUT1)
DC_MTRB2: DCM2.2 U7.8(BOUT2)
DC_RST: U7.16(NRESET) ; port DC_RST
DC_SLP: U7.17(NSLEEP) ; port DC_SLP
DC_VREF: R28.1 R29.2 TP_DC_VREF1.1(point) U7.12(AVREF) U7.13(BVREF)
PA8: U8.6(1Y) ; port ENCL
PA9: U8.4(2Y) ; port ENCR
PC5: U7.23(BPHASE) ; port PHASEA
PC6: U7.20(APHASE) ; port PHASEB
PC8: U7.21(AENBL) ; port ENA
PC9: U7.22(BENBL) ; port ENB
NetC47_2: C47.2 R30.2 U7.3(VCP)
NetC48_2: C48.2 R27.1 R28.2 U7.15(V3P3OUT)
NetC49_1: C49.1 U7.2(CP2)
NetC49_2: C49.2 U7.1(CP1)
NetC51_1: C51.1 P8.2 R31.1
NetC52_1: C52.1 R33.2 R35.1 U8.1(1A)
NetC53_1: C53.1 R34.2 R36.1 U8.3(2A)
NetC54_1: C54.1 P9.2 R32.1
NetMTR1_2: MTR1.2(A) R24.2
NetP8_3: P8.3 R35.2
NetP9_3: P9.3 R36.2

Not connected (* = marked no-connect by the designer): U7 19(DECAY)*

### Notes on the sheet
- DRV8814 current limit jumpers. Default all GND (100% current)
- (near U7) For mixed decay mode, set DECAY pin floating
- (near U7) DRV8814
- OPTIONAL
- Encoders
- DC Motor Driver
- 10
- 13
- 1.0
- Matthew Hengeveld

### Library data of the parts
C43 C44 = CAP-EL-0606-SMD: as C55 on sheet Camera Module; ComponentLink2URL: http://products.nichicon.co.jp/en/pdf/XJA043/e-ud.pdf; DatasheetVersion: 08/2012; ComponentLink1Description: Manufacturer URL; Diameter: 8 mm; RoHS: TRUE; ComponentLink3Description: Package Specification; Mounting Technology: Surface Mount; ComponentLink3URL: http://products.nichicon.co.jp/en/pdf/XJA043/e-ud.pdf; Length: 10 mm; PackageReference: CAPAE-D8H10; ComponentLink1URL: http://www.nichicon.co.jp/; ComponentLink2Description: Datasheet; PackageDescription: 2-Pin Surface Mount Device, Diameter 8 mm, Height 10 mm, Pitch 6.5 mm
C45-C47 C51-C54 = CMP-2006-03300-1: as C15 on sheet power supply
C48 = CMP-2006-02860-1: as C62 on sheet Camera Module
C49 = CMP-2006-03036-1: as C63 on sheet Camera Module
C50 = CMP-2006-01974-1: as C1 on sheet microcontroller
DCM1 DCM2 = Header 2: Header, 2-Pin; LatestRevisionDate: 17-Jul-2002; LatestRevisionNote: Re-released for DXP Platform.; Publisher: Altium Limited
MTR1 = CMP-1426-00011-1: as PWR1 on sheet power supply; Color: Red; PackageReference: 0805_A; ComponentLink2Description: Datasheet; ComponentLink1URL: http://www.we-online.com; ComponentLink1Description: Manufacturer URL; ComponentLink2URL: http://katalog.we-online.com/led/datasheet/150080RS75000.pdf
P8 P9 = Header 3: Header, 3-Pin; LatestRevisionDate: 17-Jul-2002; LatestRevisionNote: Re-released for DXP Platform.; Publisher: Altium Limited
R24 R27-R36 = CMP-2000-00704-1: as R12 on sheet power supply
R25 R26 = CMP-1238-00003-1: Low Ohmic Thick Film Chip Resistor, 0.47 Ohm, -55 to 125 degC, 2-Pin SMD, RoHS, Tape; PartNumber: MCR100JZHFLR470; Manufacturer: ROHM Semiconductor; Overload Voltage: 6.02 V Max.; Limiting Element Voltage: 3.01 V; Resistance Tolerance: +/-1%; PackageDescription: 2-Pin Chip Resistor, Body 6.3 x 3.2 mm, Height 0.7 mm; Rated Power@70 degC: 1 W; ComponentLink3Description: Package Specification; ComponentLink2Description: Datasheet; Resistance: 0.47 Ohm; Packing: Tape; DatasheetVersion: Rev. C; ComponentLink2URL: http://rohmfs.rohm.com/en/products/databook/datasheet/passive/resistor/chip_resistor/mcr_low.pdf; Operating Temperature: -55 to 125 degC; ComponentLink3URL: http://rohmfs.rohm.com/en/products/databook/datasheet/passive/resistor/chip_resistor/mcr_low.pdf; ComponentLink1URL: http://www.rohm.com/web/global/; Mounting Technology: Surface Mount; RoHS: TRUE; ComponentLink1Description: Manufacturer URL
U7 = DRV8814: GateName_1: G$1; SymbolName_1: DRV8814; LibraryName: DRV88xx; DeviceSetName: DRV8814; Package: HTSSOP28PWP

## Sheet LCD.SchDoc
size A
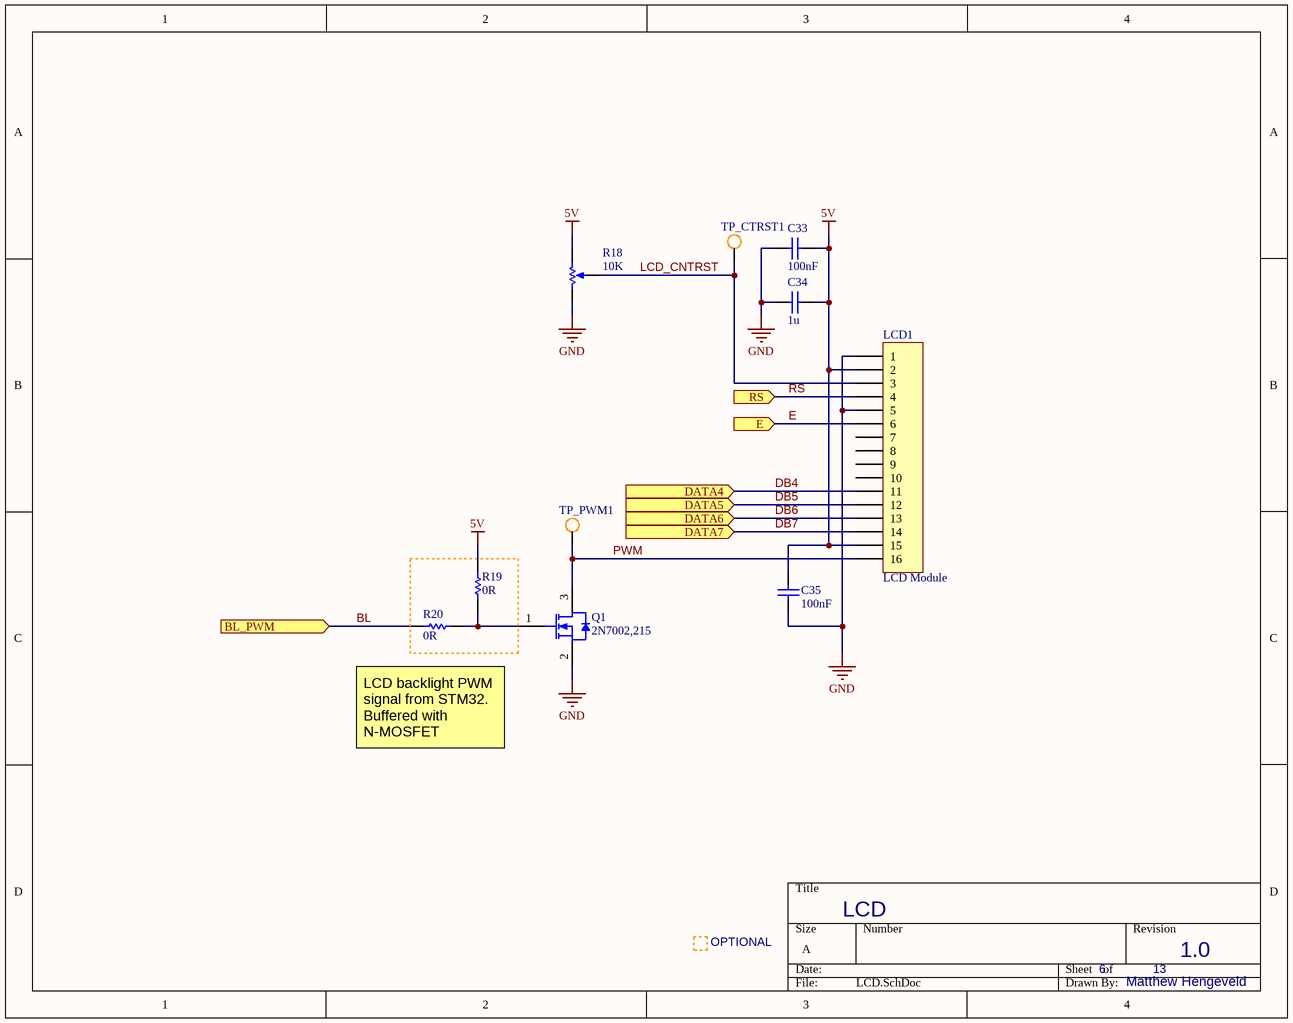
[diagram p5: LCD.SchDoc]

### Parts
C33  100nF  [CAPC1608X92X38LL15T08]
C34  1u  [CAPC2013X94X50LL20T25]
C35  100nF  [CAPC1608X92X38LL15T08]
LCD1  LCD Module  [LCD Module]
Q1  2N7002,215  [NXP-SOT23_L]
R18  10K  [BOUR-3266W-3_V]
R19  0R  [RESC1609X55X30LL10T20]
R20  0R  [RESC1609X55X30LL10T20]
TP_CTRST1  Test point  [SMD Test Hook]  (value not drawn)
TP_PWM1  Test point  [SMD Test Hook]  (value not drawn)

### Ports
BL_PWM (in), DATA4 (in), DATA5 (in), DATA6 (in), DATA7 (in), E (in), RS (in)

### Nets
5V: C33.1 C34.1 C35.2 LCD1.2 LCD1.15 R18.1(CCW) R19.2
GND: C33.2 C34.2 C35.1 LCD1.1 LCD1.5 Q1.2(S) R18.3(CW)  [project net AGND]
BL: R20.2 ; port BL_PWM
DB4: LCD1.11 ; port DATA4
DB5: LCD1.12 ; port DATA5
DB6: LCD1.13 ; port DATA6
DB7: LCD1.14 ; port DATA7
E: LCD1.6 ; port E
LCD_CNTRST: LCD1.3 R18.2(WIPER) TP_CTRST1.1(point)
PWM: LCD1.16 Q1.3(D) TP_PWM1.1(point)
RS: LCD1.4 ; port RS  [project net PA4]
NetQ1_1: Q1.1(G) R19.1 R20.1

Not connected (* = marked no-connect by the designer): LCD1 7 8 9 10

### Notes on the sheet
- LCD backlight PWM signal from STM32. Buffered with N-MOSFET
- OPTIONAL
- LCD
- 6
- 13
- 1.0
- Matthew Hengeveld

### Library data of the parts
C33 C35 = CMP-2006-01974-1: as C1 on sheet microcontroller
C34 = CMP-2007-04370-1: as C7 on sheet power supply
LCD1 = LCD Module: Header, 16-Pin; LatestRevisionDate: 17-Jul-2002; LatestRevisionNote: Re-released for DXP Platform.; Publisher: Altium Limited
Q1 = CMP-1258-00136-1: N-Channel Trench MOSFET, 60 V, 0.3 A, 3-Pin SOT23, Tape and Reel; Manufacturer: NXP Semiconductors; ID [max] (A): 0.3; Channel Type: N; VDS [max] (V): 60; Packing: Tape & Reel; VGSth [typ] (V): 2; Qr [typ] (nC): 30; Coss [typ] (pF): 6.8; Ciss [typ] (pF): 31; Mounting Technology: Surface Mount; PackageReference: SOT23; ComponentLink3Description: Package Specification; ComponentLink2Description: Datasheet; DatasheetVersion: Rev. 7; PackageVersion: 06-03-16, 03/2006; ComponentLink2URL: http://www.nxp.com/documents/data_sheet/2N7002.pdf; PackageDescription: 3-Pin Small Outline Transistor Package, Body 2.9 x 1.3 mm, Pitch 0.95 mm; PartNumber: 2N7002,215; ComponentLink1URL: http://www.nxp.com/; ComponentLink1Description: Manufacturer URL; Code_JEDEC: TO-236AB; ComponentLink3URL: http://www.nxp.com/documents/outline_drawing/sot023_po.pdf
R18 = CMP-0975-00021-1: Square Trimpot Trimming Potentiometer, 100 KOhm, 0.25 W, -55 to 125 degC, 3-Pin THD, RoHS, Tube; Manufacturer: Bourns; PartNumber: 3266W-1-104LF; Power Rating@70 degC: 0.25 W; Tolerance: +/-10%; ComponentLink2URL: https://www.bourns.com/data/global/pdfs/3266.pdf; ComponentLink3Description: Package Specification; ComponentLink1URL: https://www.bourns.com/; ComponentLink2Description: Datasheet; DatasheetVersion: Apr-14; ComponentLink3URL: https://www.bourns.com/data/global/pdfs/3266.pdf; Mounting Technology: Through Hole; Packing: Tube; PackageDescription: 3-Pin THD, Body 6.35 x 4.31 mm, Pitch 2.54 mm; ComponentLink1Description: Manufacturer URL; Operating Temperature: -55 to 125 degC; Resistance: 100 kOhm; RoHS: TRUE
R19 R20 = CMP-2000-03816-1: Part Number: CRCW06030000Z0EA; Manufacturer: Vishay Dale

## Sheet rs232.SchDoc
size A
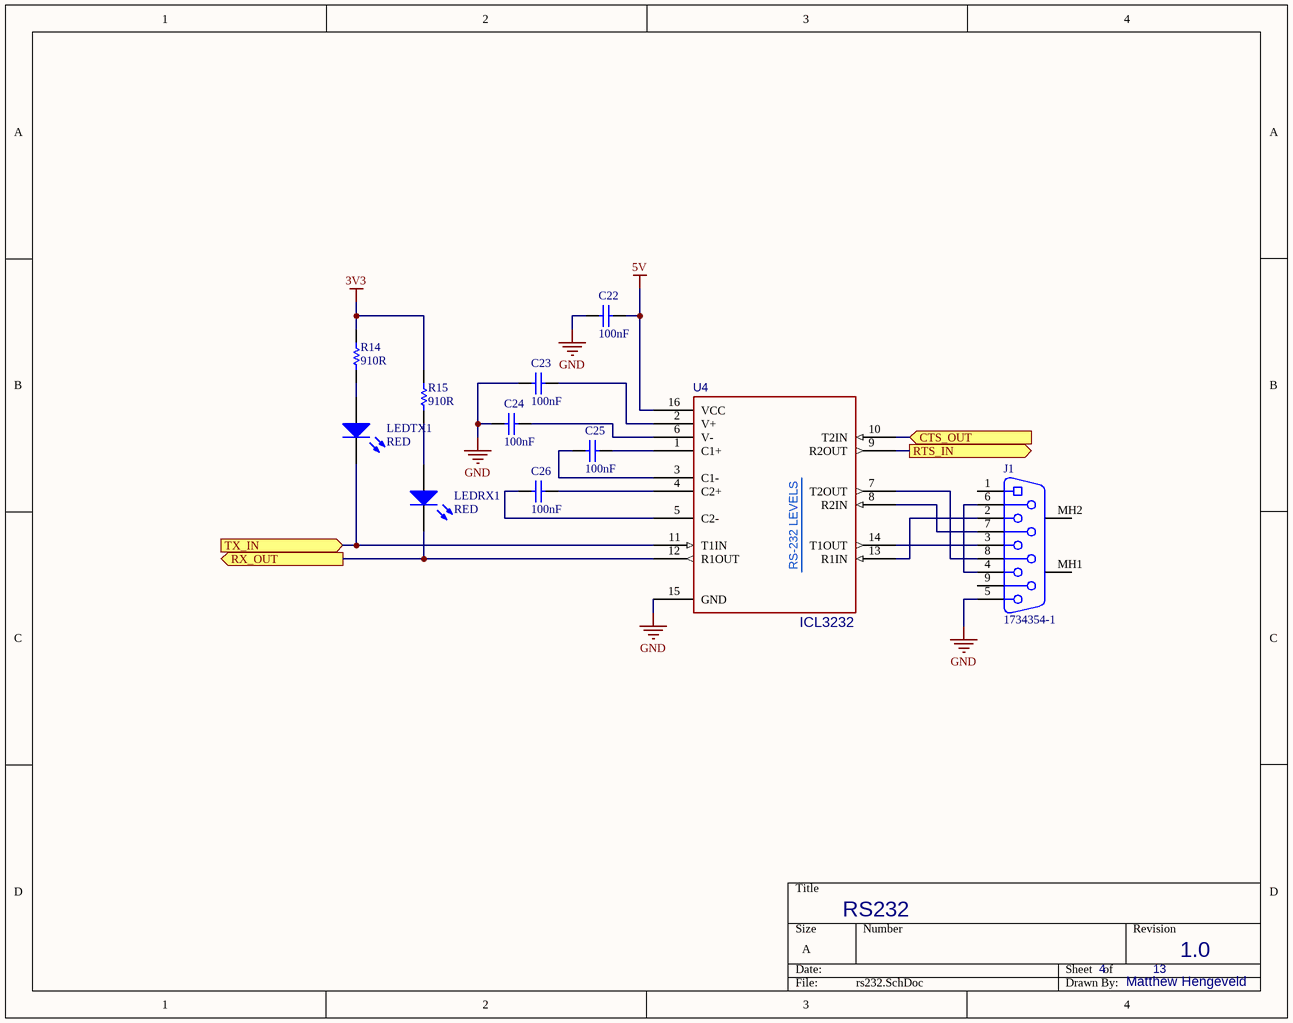
[diagram p6: rs232.SchDoc]

### Parts
C22  100nF  [CAPC1608X92X38LL15T08]
C23  100nF  [CAPC2013X94X50LL20T25]
C24  100nF  [CAPC2013X94X50LL20T25]
C25  100nF  [CAPC2013X94X50LL20T25]
C26  100nF  [CAPC2013X94X50LL20T25]
J1  1734354-1  [TE-1734354-1-9_V]
LEDRX1  RED  [0805_A]
LEDTX1  RED  [0805_A]
R14  910R  [RESC1609X50X30LL10T20]
R15  910R  [RESC1609X50X30LL10T20]
U4  RS232 Transciever  [TSSOP-16]  (value not drawn)

### Ports
CTS_OUT (in), RTS_IN (out), RX_OUT (out), TX_IN (in)

### Nets
3V3: R14.2 R15.2
5V: C22.2 U4.16(VCC)
GND: C22.1 C23.2 C24.2 J1.5 U4.15(GND)  [project net AGND]
PA0: U4.10(T2IN) ; port CTS_OUT
PA1: U4.9(R2OUT) ; port RTS_IN
PA2: LEDTX1.1(K) U4.11(T1IN) ; port TX_IN
PA3: LEDRX1.1(K) U4.12(R1OUT) ; port RX_OUT
NetC23_1: C23.1 U4.2(V+)
NetC24_1: C24.1 U4.6(V-)
NetC25_1: C25.1 U4.1(C1+)
NetC25_2: C25.2 U4.3(C1-)
NetC26_1: C26.1 U4.5(C2-)
NetC26_2: C26.2 U4.4(C2+)
NetJ1_2: J1.2 U4.13(R1IN)
NetJ1_3: J1.3 U4.14(T1OUT)
NetJ1_4: J1.4 J1.6
NetJ1_7: J1.7 U4.8(R2IN)
NetJ1_8: J1.8 U4.7(T2OUT)
NetLEDRX1_2: LEDRX1.2(A) R15.1
NetLEDTX1_2: LEDTX1.2(A) R14.1

Not connected (* = marked no-connect by the designer): J1 1 9 MH1 MH2

### Notes on the sheet
- RS232
- 4
- 13
- 1.0
- Matthew Hengeveld
- (in symbol ICL3232) RS-232 LEVELS

### Library data of the parts
C22 = CMP-2006-01974-1: as C1 on sheet microcontroller
C23-C26 = CMP-2007-04370-1: as C7 on sheet power supply
J1 = CMP-2000-05403-1: D-Subminiature Socket, Pitch 1.385 mm, 9 Position, Height 12.5 mm, Tail Length 3.2 mm, RoHS, Tray; Manufacturer: TE Connectivity; Connector Type: Receptacle,FemaleSockets; Number of Positions: 9; Connector Style: D-Sub; Catalog Drawings: AMPD-SubMale.318; 3D Model: 1734354-1.pdf; Flange Feature: MatingSide;FemaleScrewlock(4-40); Other Names: A35107; Current Rating: 2A; Voltage Rating: 250V; Mating Products: AML09B-ND / -CONND-SUBPLUG9POSGOLD; Featured Product: AMPLIMITED-SubminiatureConnectors; Product Training Modules: AMPLIMITED-SubConnectors; Dynamic Catalog: AMPLIMITEHD-20Series; Manufacturer URL: http://www.te.com/; Number of Rows: 2; Contact Type: Signal; RoHS Information: 1734354-1StatementofCompliance; Datasheet URL: http://www.te.com.cn/chn-zh/search.html?q=1734354-1&source=header#pdp-optional-registration; Features: BoardLock; Standard Package: 90; Family: D-SubConnectors; Datasheet Version: Rev. A1, 03/2011; Shell Material, Finish: Steel,NickelPlated; Color: Black; Contact Finish Thickness: Flash; Shell Size, Connector Layout: 1(DE,E); Mounting Type: ThroughHole,RightAngle; Contact Finish: Gold; Termination: Solder; Housing Material: Polyamide(PA9T),Nylon9T,GlassFilled; Operating Temperature: -55degC~105degC; Category: Connectors,Interconnects; Series: AMPLIMITEHD-20
LEDRX1 LEDTX1 = CMP-1426-00011-1: as PWR1 on sheet power supply; Color: Red; PackageReference: 0805_A; ComponentLink2Description: Datasheet; ComponentLink1URL: http://www.we-online.com; ComponentLink1Description: Manufacturer URL; ComponentLink2URL: http://katalog.we-online.com/led/datasheet/150080RS75000.pdf
R14 R15 = CMP-2000-03413-1: Part Number: CRCW06034K70JNEA; Manufacturer: Vishay Dale
U4 = ICL3232

## Sheet CANbus.SchDoc
size A
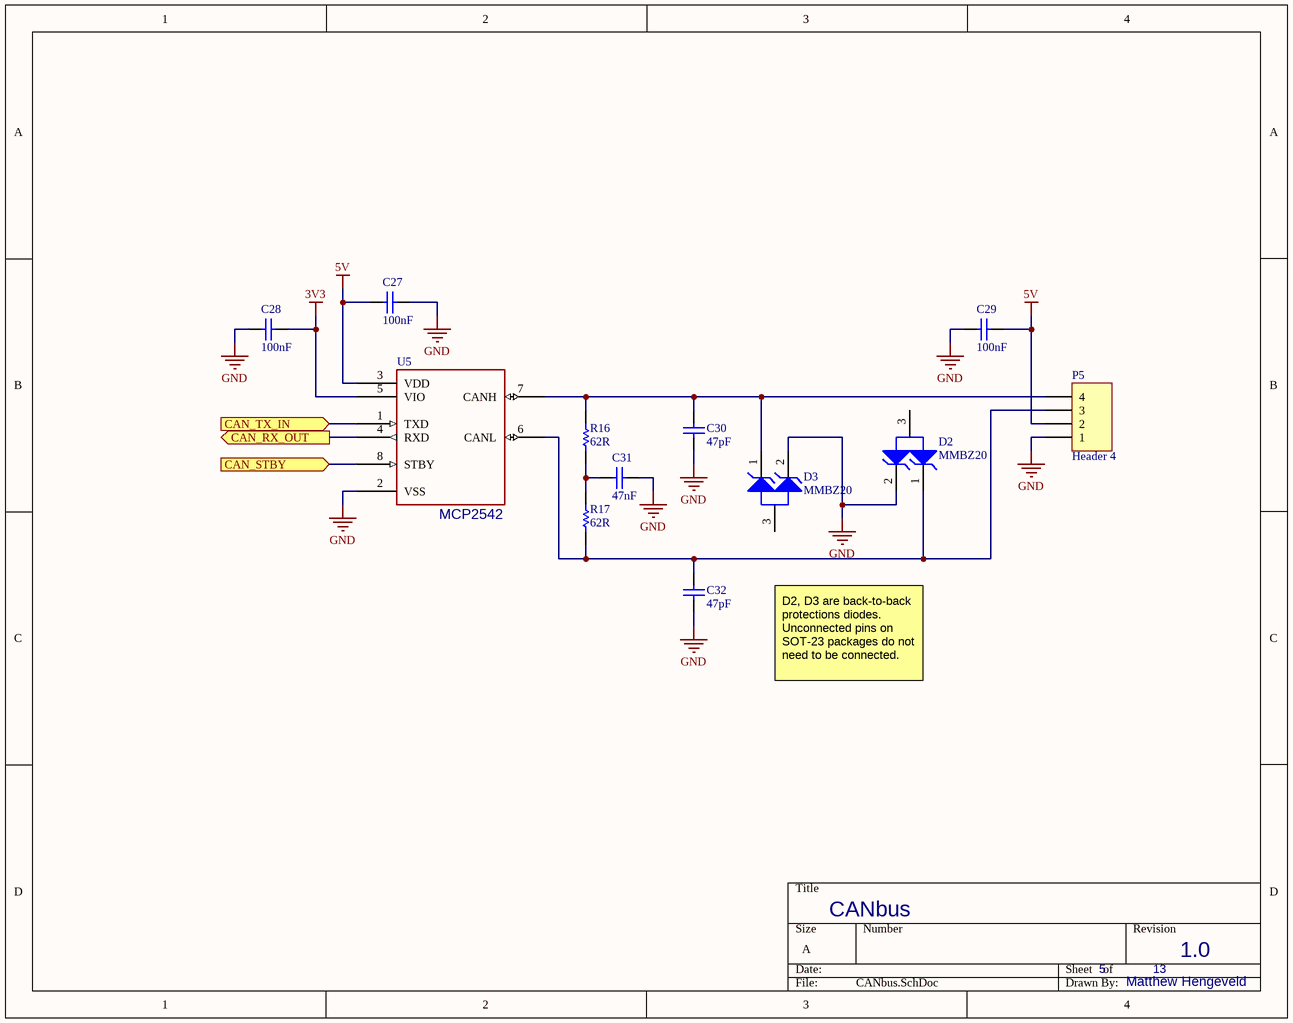
[diagram p7: CANbus.SchDoc]

### Parts
C27  100nF  [CAPC1608X92X38LL15T08]
C28  100nF  [CAPC1608X92X38LL15T08]
C29  100nF  [CAPC1608X92X38LL15T08]
C30  47pF  [CAPC1608X87X35LL15T15]
C31  47nF  [CAPC2013X88X50LL20T25]
C32  47pF  [CAPC1608X87X35LL15T15]
D2  MMBZ20  [SOT-23-3]
D3  MMBZ20  [SOT-23-3]
P5  Header 4  [HDR1X4]
R16  62R  [RESC3216X70X50LL05T20]
R17  62R  [RESC3216X70X50LL05T20]
U5  MCP2542  [MCHP-SOIC-SN8_N]  (value not drawn)

### Ports
CAN_RX_OUT (out), CAN_STBY (in), CAN_TX_IN (in)

### Nets
3V3: C28.2 U5.5(VIO)
5V: C27.1 C29.2 P5.2 U5.3(VDD)
GND: C27.2 C28.1 C29.1 C30.1 C31.2 C32.1 D2.2(K2) D3.2(K2) P5.1 U5.2(VSS)  [project net AGND]
PA11: U5.4(RXD) ; port CAN_RX_OUT
PA12: U5.1(TXD) ; port CAN_TX_IN
PB11: U5.8(STBY) ; port CAN_STBY
NetC30_2: C30.2 D3.1(K1) P5.4 R16.2 U5.7(CANH)
NetC31_1: C31.1 R16.1 R17.2
NetC32_2: C32.2 D2.1(K1) P5.3 R17.1 U5.6(CANL)

Not connected (* = marked no-connect by the designer): D2 3(A); D3 3(A)

### Notes on the sheet
- D2, D3 are back-to-back protections diodes. Unconnected pins on SOT-23 packages do not need to be connected.
- CANbus
- 5
- 13
- 1.0
- Matthew Hengeveld

### Library data of the parts
C27-C29 = CMP-2006-01974-1: as C1 on sheet microcontroller
C30 C32 = CMP-2006-03321-1: Manufacturer: Kemet; Part Number: C0603C470J1GACTU
C31 = CMP-2007-00392-1: Manufacturer: Kemet; Part Number: C0805C473K3RACTU
D2 D3 = TVS Diode: Transient Voltage Suppressor Diode Array, Dual Common Anode Diodes for ESD Protection, 3-Pin SOT-23, Pb-Free, Tape and Reel; PartNumber: SM12T1G; Manufacturer: On Semiconductor; PPK Max (W): 300; IR Max (uA): 1; Direction: Unidirectional; Mounting Technology: Surface Mount; RoHS: Pb-Free; ComponentLink3URL: http://www.onsemi.cn/pub_link/Collateral/318-08.PDF; ComponentLink2Description: Datasheet; ComponentLink1URL: http://www.onsemi.com/; ComponentLink3Description: Package Specification; PackageReference: SOT-23-3-318-08; ComponentLink2URL: http://www.onsemi.com/pub_link/Collateral/SM12T1-D.PDF; Packing: Tape and Reel; DatasheetVersion: Rev. 6; PackageVersion: Rev. AP, 11/2009; ComponentLink1Description: Manufacturer URL; PackageDescription: 3-Pin Small Outline Transistor, Body 2.92 x 1.3 mm, Pitch 0.95 mm
P5 = Header 4: Header, 4-Pin; LatestRevisionDate: 17-Jul-2002; LatestRevisionNote: Re-released for DXP Platform.; Publisher: Altium Limited
R16 R17 = CMP-2003-00795-1: Part Number: ERJ8CWFR024V; Manufacturer: Panasonic

## Sheet IO Expansioin.SchDoc
size A
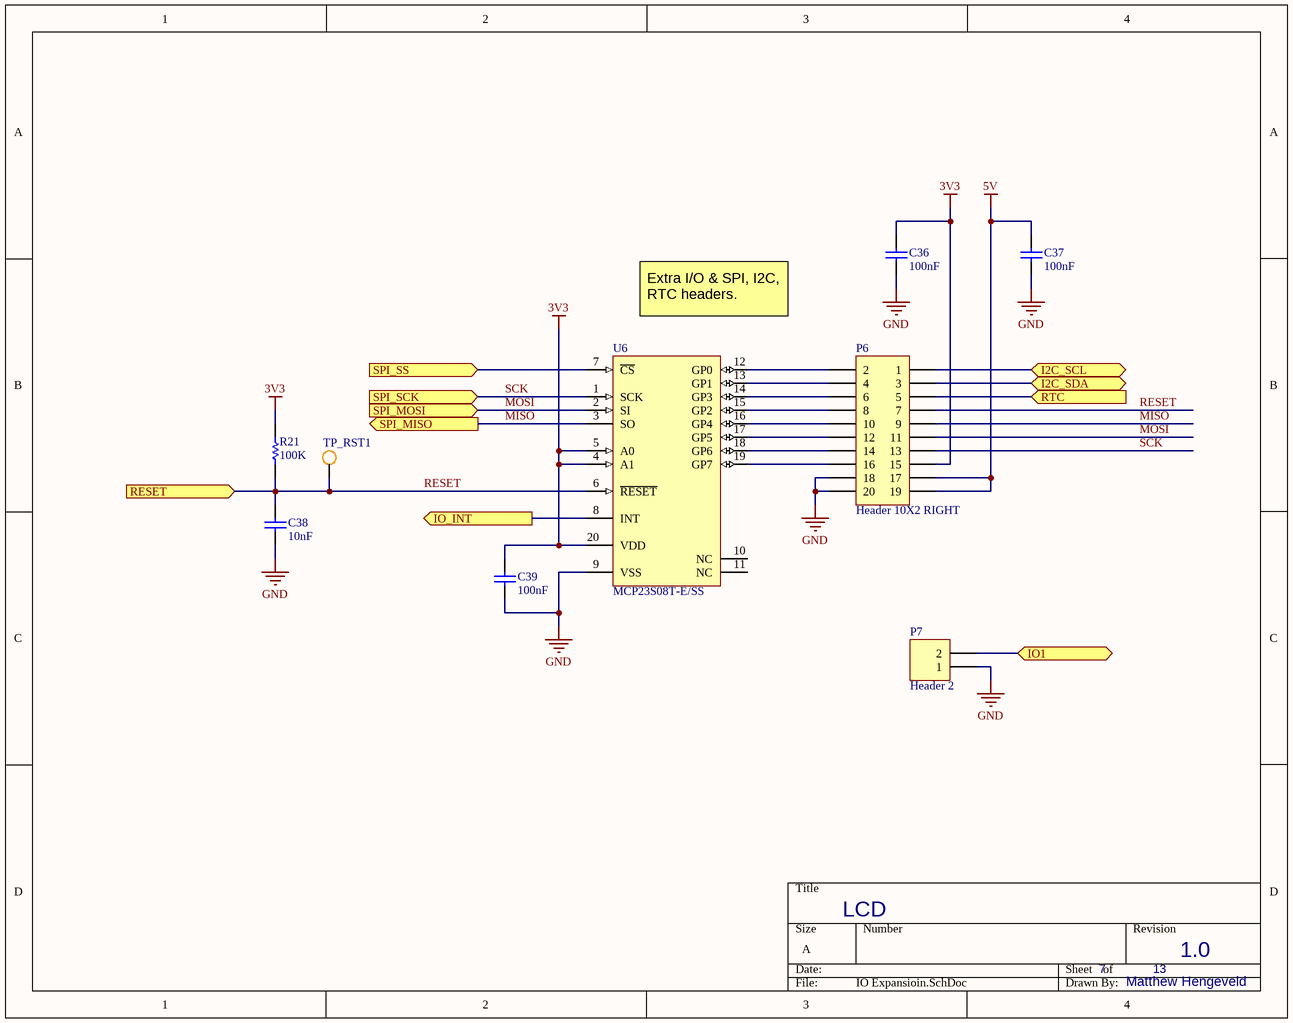
[diagram p8: IO Expansioin.SchDoc]

### Parts
C36  100nF  [CAPC1608X92X38LL15T08]
C37  100nF  [CAPC1608X92X38LL15T08]
C38  10nF  [CAPC1608X92X38LL15T08]
C39  100nF  [CAPC1608X92X38LL15T08]
P6  Header 10X2 RIGHT  [HDR2X10 RIGHT]
P7  Header 2  [HDR1X2]
R21  100K  [RESC1608X55X30LL15T15]
TP_RST1  Test point  [SMD Test Hook]  (value not drawn)
U6  MCP23S08T-E/SS  [SSOP-20]

### Ports
I2C_SCL (bidir), I2C_SDA (bidir), IO1 (bidir), IO_INT (out), RESET (in), RTC (in), SPI_MISO (out), SPI_MOSI (in), SPI_SCK (in), SPI_SS (in)

### Nets
3V3: C36.2 C39.2 P6.15 R21.1 U6.4(A1) U6.5(A0) U6.20(VDD)
5V: C37.2 P6.17 P6.19
GND: C36.1 C37.1 C38.1 C39.1 P6.18 P6.20 P7.1 U6.9(VSS)  [project net AGND]
I2C_SCL: P6.1 ; port I2C_SCL
I2C_SDA: P6.3 ; port I2C_SDA
MISO: P6.9 U6.3(SO) ; port SPI_MISO
MOSI: P6.11 U6.2(SI) ; port SPI_MOSI
PA5: P7.2 ; port IO1
PB10: U6.8(INT) ; port IO_INT
PB12: U6.7(~{CS}) ; port SPI_SS
PC13: P6.5 ; port RTC
RESET: C38.2 P6.7 R21.2 TP_RST1.1(point) U6.6(~{RESET}) ; port RESET
SCK: P6.13 U6.1(SCK) ; port SPI_SCK  [project net PB13]
NetP6_2: P6.2 U6.12(GP0)
NetP6_4: P6.4 U6.13(GP1)
NetP6_6: P6.6 U6.14(GP3)
NetP6_8: P6.8 U6.15(GP2)
NetP6_10: P6.10 U6.16(GP4)
NetP6_12: P6.12 U6.17(GP5)
NetP6_14: P6.14 U6.18(GP6)
NetP6_16: P6.16 U6.19(GP7)

Not connected (* = marked no-connect by the designer): U6 10(NC) 11(NC)

### Notes on the sheet
- Extra I/O & SPI, I2C, RTC headers.
- LCD
- 7
- 13
- 1.0
- Matthew Hengeveld

### Library data of the parts
C36-C39 = CMP-2006-01974-1: as C1 on sheet microcontroller
P6 = Header 10X2 RIGHT: Header, 10-Pin, Dual row, Right Angle; LatestRevisionDate: 17-Jul-2002; LatestRevisionNote: Re-released for DXP Platform.; Publisher: Altium Limited
P7 = Header 2: Header, 2-Pin; LatestRevisionDate: 17-Jul-2002; LatestRevisionNote: Re-released for DXP Platform.; Publisher: Altium Limited
R21 = CMP-2000-00704-1: as R12 on sheet power supply
U6 = CMP-0186-00165-3: 8-Bit I/O Expander with Serial Interface, 20-Pin SSOP, Extended Temperature, Tape and Reel; PackageReference: SSOP-SS20; ComponentLink3URL: http://www.microchip.com/stellent/groups/techpub_sg/documents/packagingspec/en012702.pdf; ComponentLink1URL: http://www.microchip.com/; ComponentLink1Description: Manufacturer URL; DatasheetVersion: revE, Aug-2007; Code_JEDEC: MO-150; ComponentLink3Description: Package Specification; PackageVersion: revBB, Aug-2009; PackageDescription: 20-Lead Plastic Shrink Small Outline (SS) - 5.3mm Body [SSOP]; RevisionNote: Sch corrected.; ComponentLink2Description: Datasheet; ComponentLink2URL: http://ww1.microchip.com/downloads/en/DeviceDoc/21919e.pdf

## Sheet Temperature.SchDoc
size A4
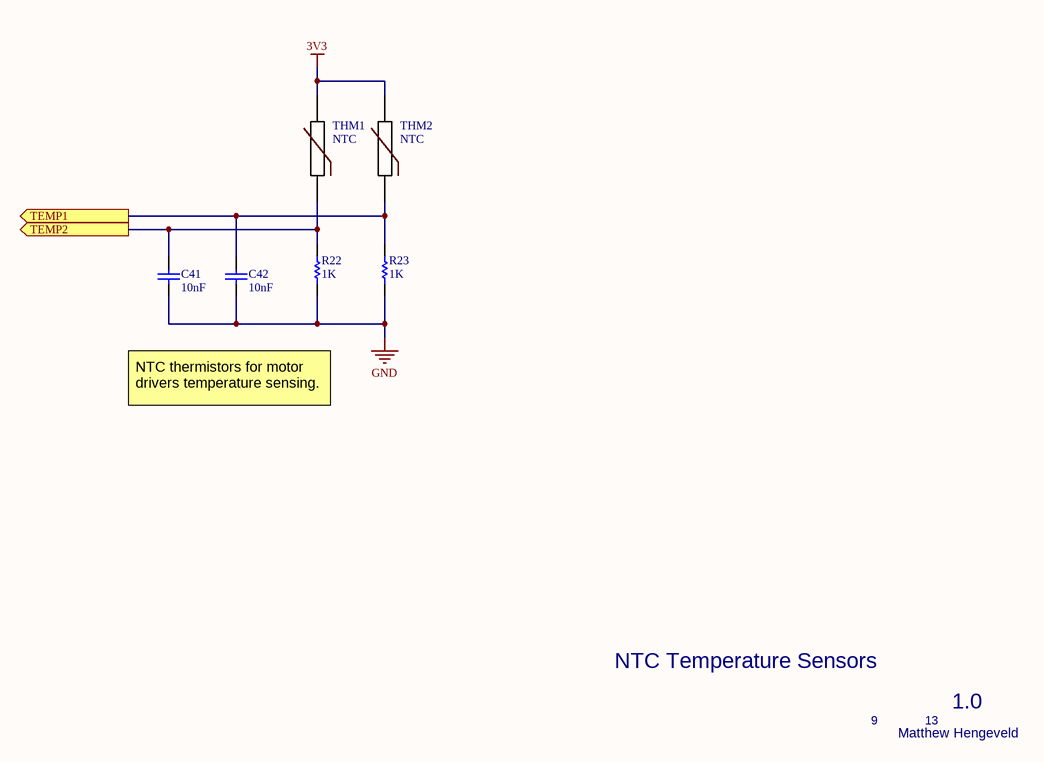
[diagram p9: Temperature.SchDoc]

### Parts
C41  10nF  [CAPC1608X92X38LL15T08]
C42  10nF  [CAPC1608X92X38LL15T08]
R22  1K  [RESC1608X55X30LL15T15]
R23  1K  [RESC1608X55X30LL15T15]
THM1  NTC  [NTC]
THM2  NTC  [NTC]

### Ports
TEMP1 (out), TEMP2 (out)

### Nets
3V3: THM1.2 THM2.2
GND: C41.1 C42.1 R22.1 R23.1  [project net AGND]
PA6: C42.2 R23.2 THM2.1 ; port TEMP1
PA7: C41.2 R22.2 THM1.1 ; port TEMP2

### Notes on the sheet
- NTC thermistors for motor drivers temperature sensing.
- NTC Temperature Sensors
- 9
- 13
- 1.0
- Matthew Hengeveld

### Library data of the parts
C41 C42 = CMP-2006-01974-1: as C1 on sheet microcontroller
R22 R23 = CMP-2000-00704-1: as R12 on sheet power supply

## Sheet SD card.SchDoc
size A4
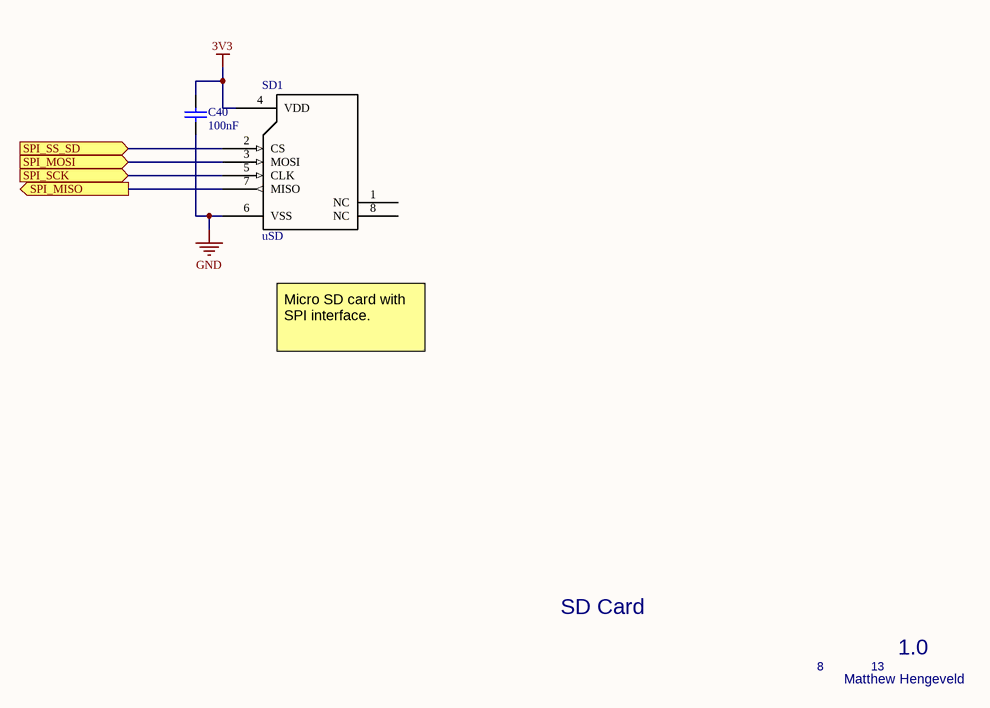
[diagram p10: SD card.SchDoc]

### Parts
C40  100nF  [CAPC1608X92X38LL15T08]
SD1  uSD  [uSD]

### Ports
SPI_MISO (out), SPI_MOSI (in), SPI_SCK (in), SPI_SS_SD (in)

### Nets
3V3: C40.2 SD1.4(VDD)
GND: C40.1 SD1.6(VSS)  [project net AGND]
MISO: SD1.7(MISO) ; port SPI_MISO
MOSI: SD1.3(MOSI) ; port SPI_MOSI
PB6: SD1.2(CS) ; port SPI_SS_SD
PB13: SD1.5(CLK) ; port SPI_SCK

Not connected (* = marked no-connect by the designer): SD1 1(NC) 8(NC)

### Notes on the sheet
- Micro SD card with SPI interface.
- SD Card
- 8
- 13
- 1.0
- Matthew Hengeveld

### Library data of the parts
C40 = CMP-2006-01974-1: as C1 on sheet microcontroller
SD1 = MicroSD Holder: uSD Card Holder, SPI Interface

## Sheet TestPoints.SchDoc
size A
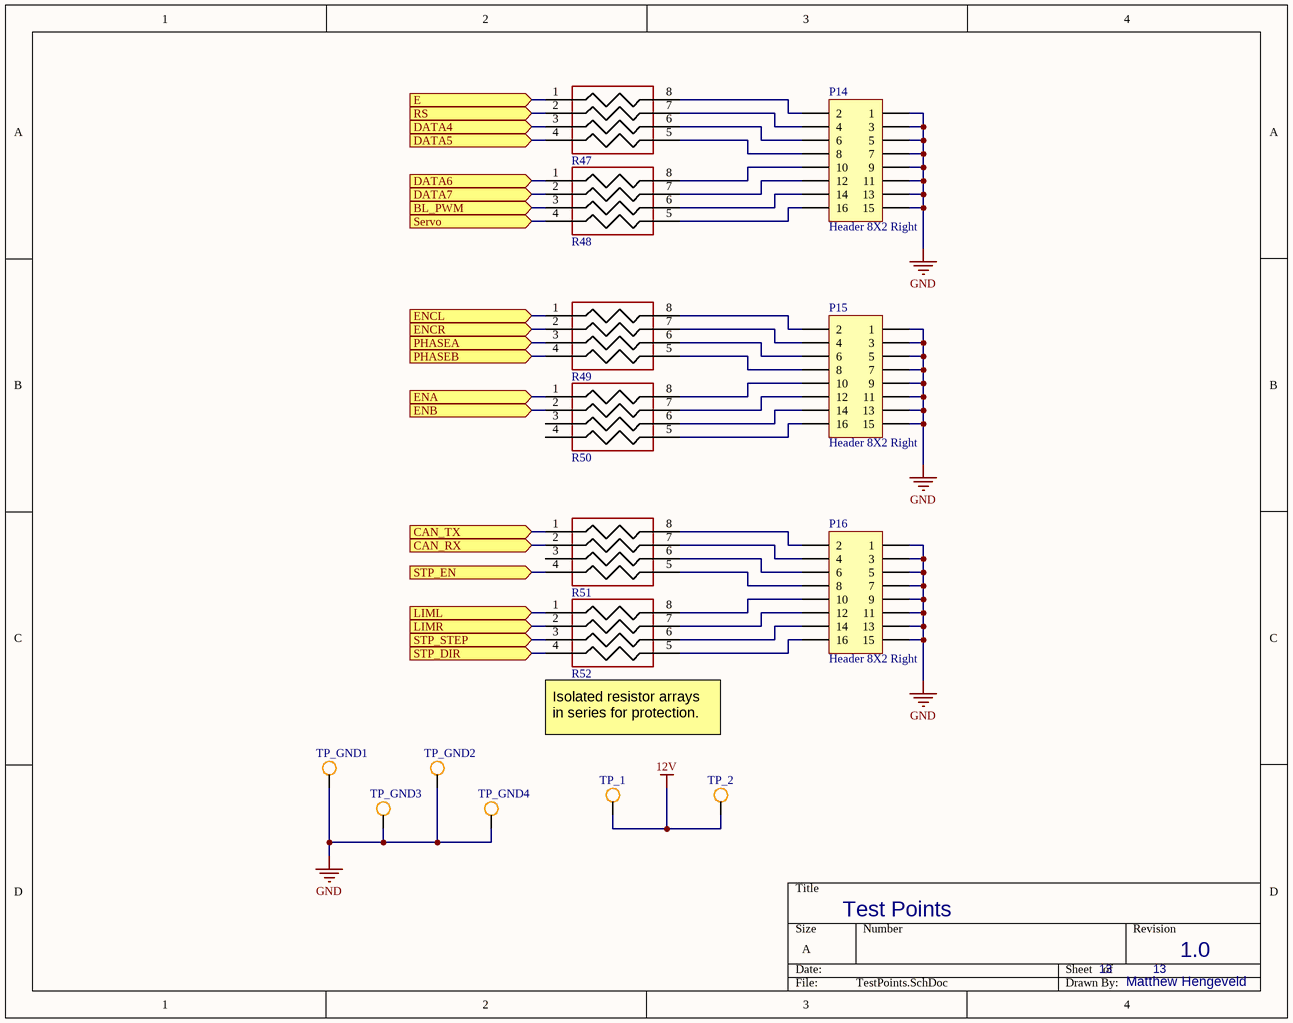
[diagram p11: TestPoints.SchDoc]

### Parts
P14  Header 8X2 Right  [HDR2X8 RIGHT]
P15  Header 8X2 Right  [HDR2X8 RIGHT]
P16  Header 8X2 Right  [HDR2X8 RIGHT]
R47  8RES_ISO_ARRAY  [4RES_ARRAY_1206]  (value not drawn)
R48  8RES_ISO_ARRAY  [4RES_ARRAY_1206]  (value not drawn)
R49  8RES_ISO_ARRAY  [4RES_ARRAY_1206]  (value not drawn)
R50  8RES_ISO_ARRAY  [4RES_ARRAY_1206]  (value not drawn)
R51  8RES_ISO_ARRAY  [4RES_ARRAY_1206]  (value not drawn)
R52  8RES_ISO_ARRAY  [4RES_ARRAY_1206]  (value not drawn)
TP_1  Test point  [SMD Test Hook]  (value not drawn)
TP_2  Test point  [SMD Test Hook]  (value not drawn)
TP_GND1  Test point  [SMD Test Hook]  (value not drawn)
TP_GND2  Test point  [SMD Test Hook]  (value not drawn)
TP_GND3  Test point  [SMD Test Hook]  (value not drawn)
TP_GND4  Test point  [SMD Test Hook]  (value not drawn)

### Ports
BL_PWM (in), CAN_RX (in), CAN_TX (in), DATA4 (in), DATA5 (in), DATA6 (in), DATA7 (in), E (in), ENA (in), ENB (in), ENCL (in), ENCR (in), LIML (in), LIMR (in), PHASEA (in), PHASEB (in), RS (in), Servo (in), STP_DIR (in), STP_EN (in), STP_STEP (in)

### Nets
12V: TP_1.1(point) TP_2.1(point)
GND: P14.1 P14.3 P14.5 P14.7 P14.9 P14.11 P14.13 P14.15 P15.1 P15.3 P15.5 P15.7 P15.9 P15.11 P15.13 P15.15 P16.1 P16.3 P16.5 P16.7 P16.9 P16.11 P16.13 P16.15 TP_GND1.1(point) TP_GND2.1(point) TP_GND3.1(point) TP_GND4.1(point)  [project net AGND]
BL: R48.3 ; port BL_PWM
DB4: R47.3 ; port DATA4
DB5: R47.4 ; port DATA5
DB6: R48.1 ; port DATA6
DB7: R48.2 ; port DATA7
E: R47.1 ; port E
PA4: R47.2 ; port RS
PA8: R49.1 ; port ENCL
PA9: R49.2 ; port ENCR
PA11: R51.2 ; port CAN_RX
PA12: R51.1 ; port CAN_TX
PA15: R48.4 ; port Servo
PB1: R52.1 ; port LIML
PB2: R52.2 ; port LIMR
PB3: R51.4 ; port STP_EN
PB4: R52.4 ; port STP_DIR
PB5: R52.3 ; port STP_STEP
PC5: R49.3 ; port PHASEA
PC6: R49.4 ; port PHASEB
PC8: R50.1 ; port ENA
PC9: R50.2 ; port ENB
NetP14_2: P14.2 R47.8
NetP14_4: P14.4 R47.7
NetP14_6: P14.6 R47.6
NetP14_8: P14.8 R47.5
NetP14_10: P14.10 R48.8
NetP14_12: P14.12 R48.7
NetP14_14: P14.14 R48.6
NetP14_16: P14.16 R48.5
NetP15_2: P15.2 R49.8
NetP15_4: P15.4 R49.7
NetP15_6: P15.6 R49.6
NetP15_8: P15.8 R49.5
NetP15_10: P15.10 R50.8
NetP15_12: P15.12 R50.7
NetP15_14: P15.14 R50.6
NetP15_16: P15.16 R50.5
NetP16_2: P16.2 R51.8
NetP16_4: P16.4 R51.7
NetP16_6: P16.6 R51.6
NetP16_8: P16.8 R51.5
NetP16_10: P16.10 R52.8
NetP16_12: P16.12 R52.7
NetP16_14: P16.14 R52.6
NetP16_16: P16.16 R52.5

Not connected (* = marked no-connect by the designer): R50 3(14) 4(14); R51 3(14)

### Notes on the sheet
- (near R52) Isolated resistor arrays in series for protection.
- Test Points
- 13
- 1.0
- Matthew Hengeveld

### Library data of the parts
P14-P16 = Header 8X2 Right: Header, 8-Pin, Dual row, Right Angle; LatestRevisionDate: 17-Jul-2002; LatestRevisionNote: Re-released for DXP Platform.; Publisher: Altium Limited
R47-R52 = 8RES_ISO_ARRAY: 4 Resistor Array

## Sheet Bluetooth.SchDoc
size A4
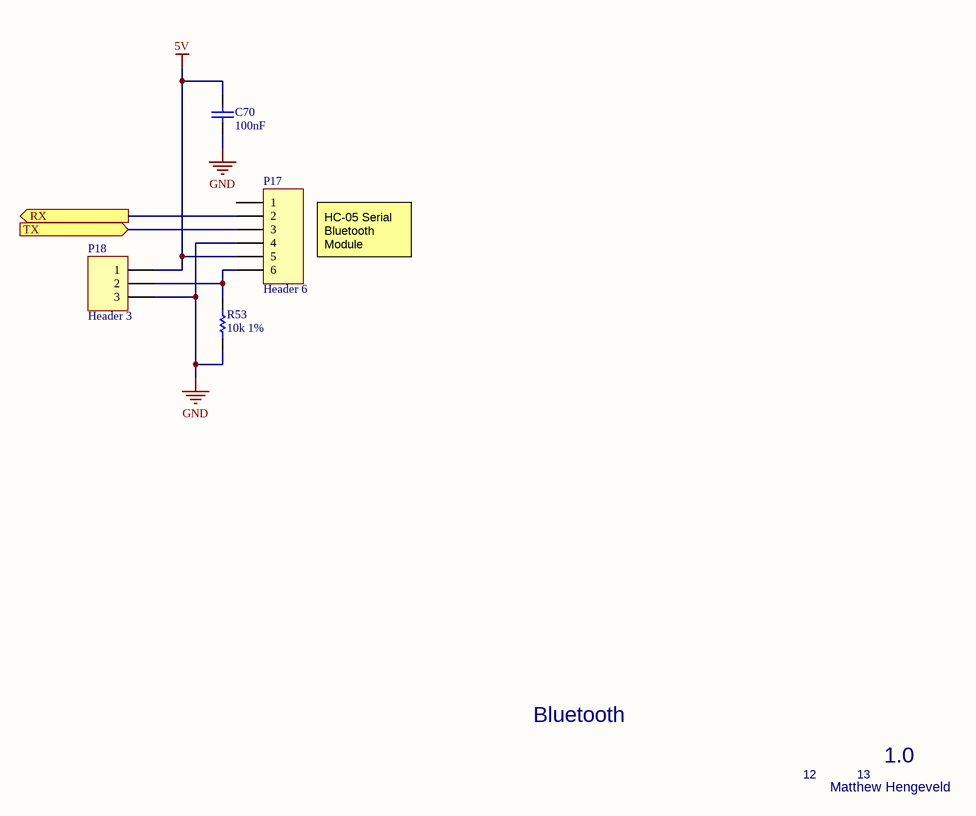
[diagram p12: Bluetooth.SchDoc]

### Parts
C70  100nF  [CAPC1608X92X38LL15T08]
P17  Header 6  [HDR1X6]
P18  Header 3  [HDR1X3]
R53  10k 1%  [RESC1608X55X30LL15T15]

### Ports
RX (out), TX (in)

### Nets
5V: C70.1 P17.5 P18.1
GND: C70.2 P17.4 P18.3 R53.1  [project net AGND]
PA2: P17.3 ; port TX
PA3: P17.2 ; port RX
NetP17_6: P17.6 P18.2 R53.2

Not connected (* = marked no-connect by the designer): P17 1

### Notes on the sheet
- HC-05 Serial Bluetooth Module
- Bluetooth
- 12
- 13
- 1.0
- Matthew Hengeveld

### Library data of the parts
C70 = CMP-2006-01974-1: as C1 on sheet microcontroller
P17 = Header 6: Header, 6-Pin; LatestRevisionDate: 17-Jul-2002; LatestRevisionNote: Re-released for DXP Platform.; Publisher: Altium Limited
P18 = Header 3: Header, 3-Pin; LatestRevisionDate: 17-Jul-2002; LatestRevisionNote: Re-released for DXP Platform.; Publisher: Altium Limited
R53 = CMP-2000-00181-1: as R5 on sheet power supply